# EAGLE design OpenMyxa (EAGLE 9.6.1)
Assembly variants: BASIC

## Sheet 1 of 2
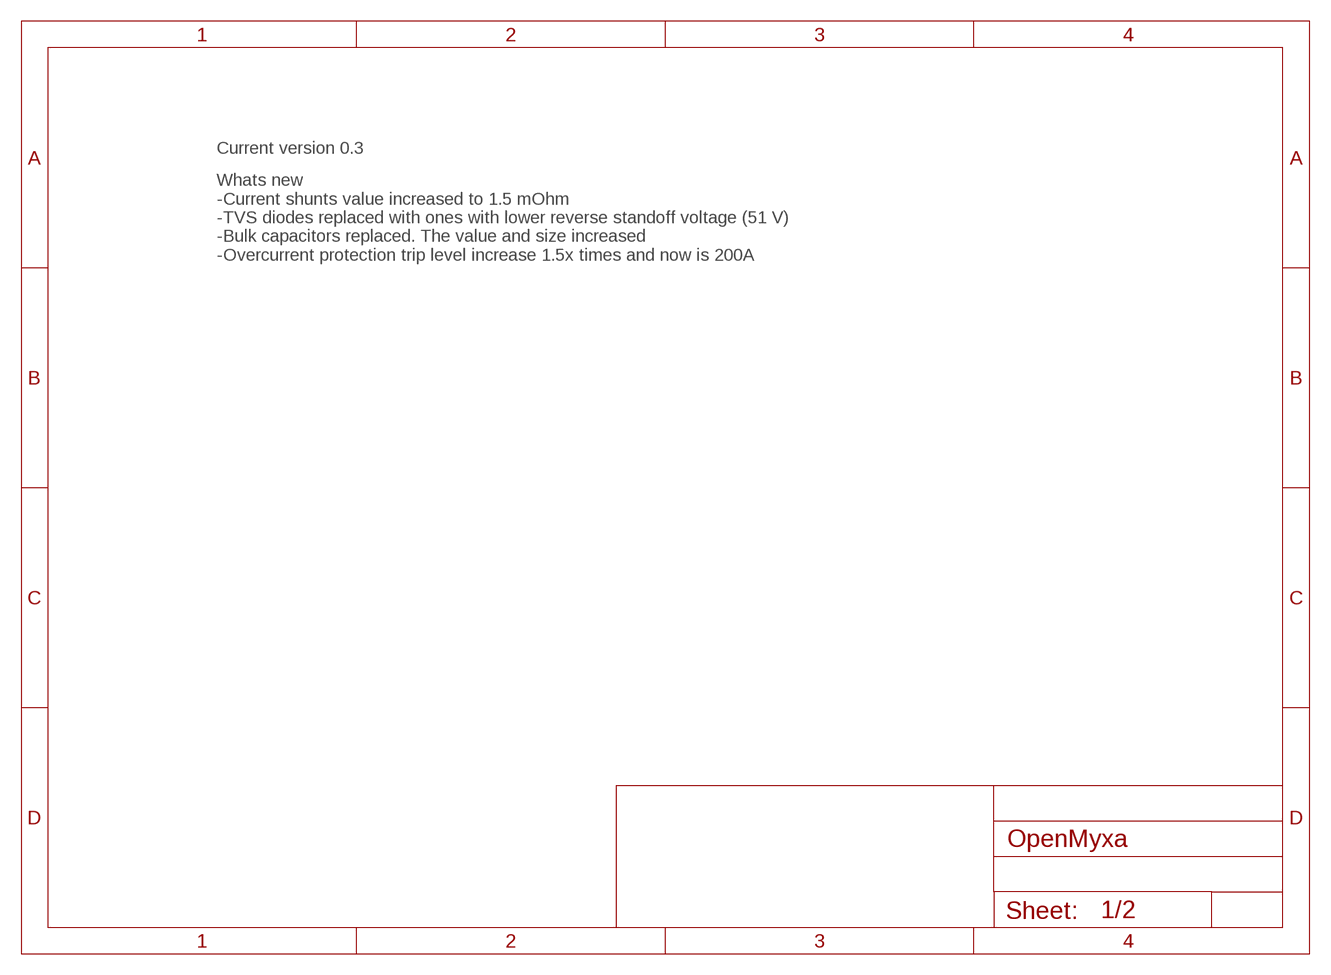
[diagram p0: schematic, sheet 1]

### Notes on the sheet
- Current version 0.3
- Whats new
  -Current shunts value increased to 1.5 mOhm
  -TVS diodes replaced with ones with lower reverse standoff voltage (51 V) 
  -Bulk capacitors replaced. The value and size increased
  -Overcurrent protection trip level increase 1.5x times and now is 200A

## Sheet 2 of 2
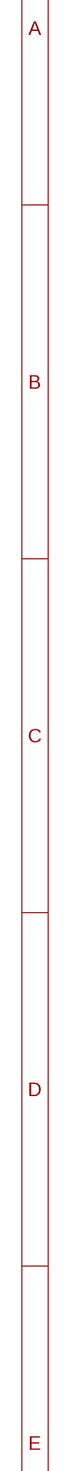
[diagram p1: schematic, sheet 2, part 1 of 2]
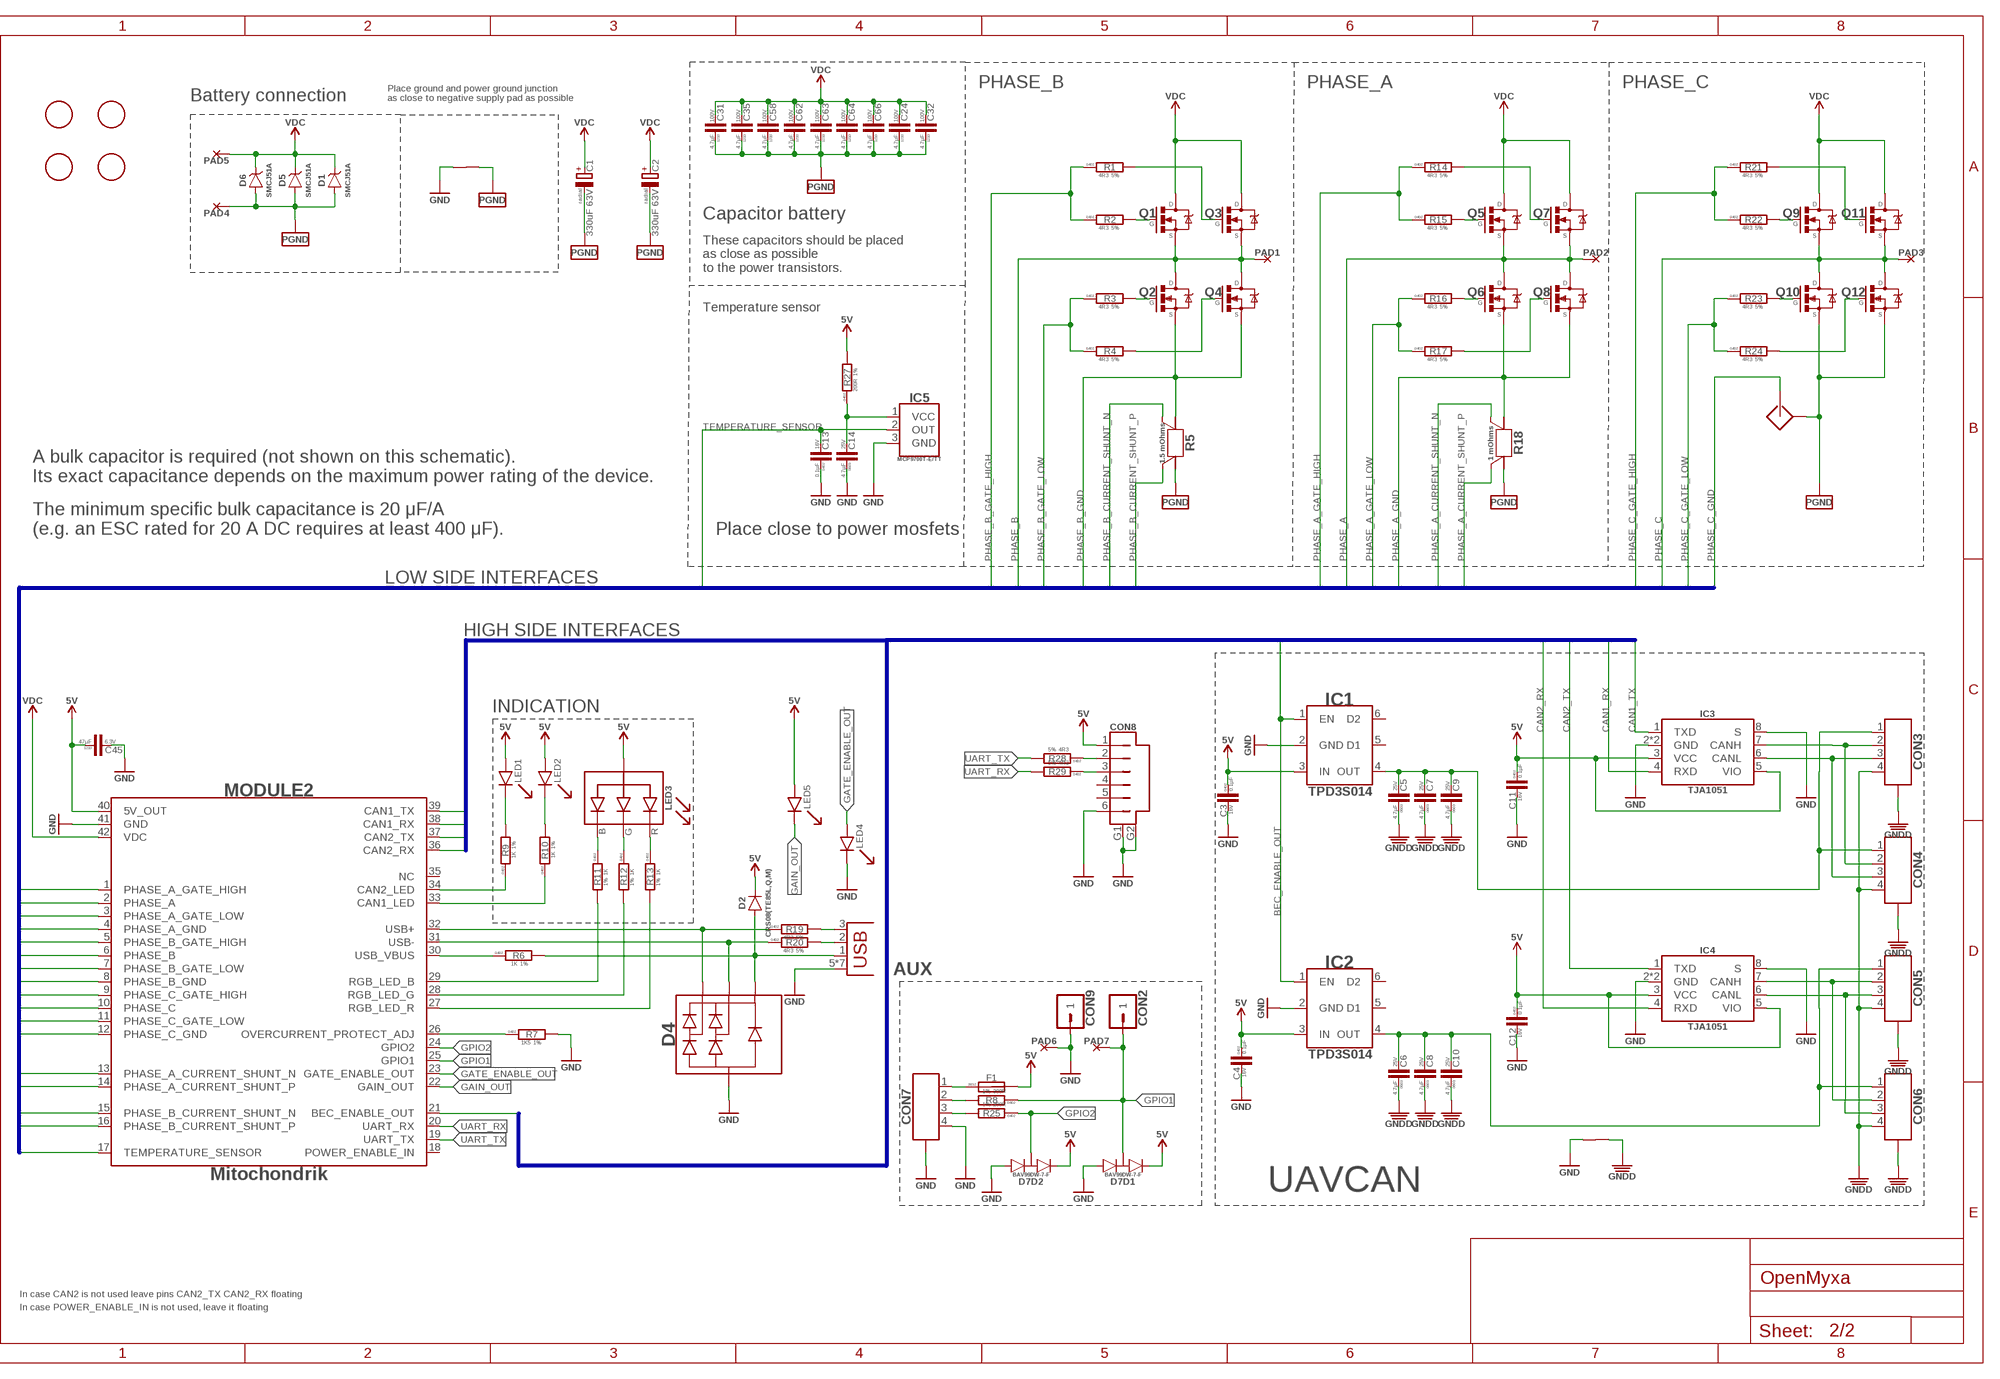
[diagram p2: schematic, sheet 2, part 2 of 2]

### Parts
C1  330uF 63V  CPOL-SIDE  [SIDE_10X22]
C2  330uF 63V  CPOL-SIDE  [SIDE_10X22]
C3  0.1µF  0.1µF-16V_10%_X7R-0402  [C0402]
C4  0.1µF  0.1µF-16V_10%_X7R-0402  [C0402]
C5  4.7µF  4.7µF-25V_10%_X6S-0603  [C0603]
C6  4.7µF  4.7µF-25V_10%_X6S-0603  [C0603]
C7  4.7µF  4.7µF-25V_10%_X6S-0603  [C0603]
C8  4.7µF  4.7µF-25V_10%_X6S-0603  [C0603]
C9  4.7µF  4.7µF-25V_10%_X6S-0603  [C0603]
C10  4.7µF  4.7µF-25V_10%_X6S-0603  [C0603]
C11  0.1µF  0.1µF-16V_10%_X7R-0402  [C0402]
C12  0.1µF  0.1µF-16V_10%_X7R-0402  [C0402]
C13  0.1µF  0.1µF-16V_10%_X7R-0402  [C0402]
C14  4.7µF  4.7µF-25V_10%_X6S-0603  [C0603]
C24  4.7µF  4.7µF-100V_20%_X7S-1210  [C1210]
C31  4.7µF  4.7µF-100V_20%_X7S-1210  [C1210]
C32  4.7µF  4.7µF-100V_20%_X7S-1210  [C1210]
C35  4.7µF  4.7µF-100V_20%_X7S-1210  [C1210]
C45  47µF  47µF-6.3V-20%-X7S-1210  [C1210]  (not fitted in variant BASIC)
C58  4.7µF  4.7µF-100V_20%_X7S-1210  [C1210]
C62  4.7µF  4.7µF-100V_20%_X7S-1210  [C1210]
C63  4.7µF  4.7µF-100V_20%_X7S-1210  [C1210]
C64  4.7µF  4.7µF-100V_20%_X7S-1210  [C1210]
C66  4.7µF  4.7µF-100V_20%_X7S-1210  [C1210]
CON1  USB  [1051330011]
CON2  PINHEAD_1X01-2  [1X01-PTH-2]  (not fitted in variant BASIC)
CON3  CON-4P-TABS-STRAIGHT  [JST_GH-4P-STRAIGHT]
CON4  CON-4P-TABS-STRAIGHT  [JST_GH-4P-STRAIGHT]
CON5  CON-4P-TABS-STRAIGHT  [JST_GH-4P-STRAIGHT]
CON6  CON-4P-TABS-STRAIGHT  [JST_GH-4P-STRAIGHT]
CON7  CON-4P-TABS-STRAIGHT  [JST_GH-4P-STRAIGHT]
CON8  CON-6P  [SM06B]
CON9  PINHEAD_1X01-2  [1X01-PTH-2]  (not fitted in variant BASIC)
D1  SMCJ51A  [DO-214AB(SMC)]
D2  CRS08-SOD123  [SOD123]
D4  PRTR5V0U2X  [SOT143B]
D5  SMCJ51A  [DO-214AB(SMC)]  (not fitted in variant BASIC)
D6  SMCJ51A  [DO-214AB(SMC)]  (not fitted in variant BASIC)
D7  BAV99DW  [SOT363]
F1  FUSE-1812  [F1812]
IC1  TPD3S014DBVR-SOT23-6  [SOT26]
IC2  TPD3S014DBVR-SOT23-6  [SOT26]
IC3  TJA1051  [SOT782-1]
IC4  TJA1051  [SOT782-1]
IC5  MCP9700  [SOT23B-3]
LED1  GREEN  LED-GREEN-0402  [0402_LED]
LED2  GREEN  LED-GREEN-0402  [0402_LED]
LED3  LTST-C19HE1WT  [LITE_ON_RGB_LED]
LED4  ORANGE  LED-ORANGE-0402  [0402_LED]
LED5  ORANGE  LED-ORANGE-0402  [0402_LED]
MODULE2  MITOHONDRIQUE_V0.2-TH  [MITOHONDRIQUE-TH]
PAD1  PAD-HOLE_2  [HOLE_2]  (not fitted in variant BASIC)
PAD2  PAD-HOLE_2  [HOLE_2]  (not fitted in variant BASIC)
PAD3  PAD-HOLE_2  [HOLE_2]  (not fitted in variant BASIC)
PAD4  PAD-HOLE_2.5  [HOLE_2.5]  (not fitted in variant BASIC)
PAD5  PAD-HOLE_2.5  [HOLE_2.5]  (not fitted in variant BASIC)
PAD6  PAD-3X1.5  [3X1.5]  (not fitted in variant BASIC)
PAD7  PAD-3X1.5  [3X1.5]  (not fitted in variant BASIC)
Q1  BSC040N08NS5ATMA1-PG-TDSON-8-7  [PG-TDSON-8-7]
Q2  BSC040N08NS5ATMA1-PG-TDSON-8-7  [PG-TDSON-8-7]
Q3  BSC040N08NS5ATMA1-PG-TDSON-8-7  [PG-TDSON-8-7]
Q4  BSC040N08NS5ATMA1-PG-TDSON-8-7  [PG-TDSON-8-7]
Q5  BSC040N08NS5ATMA1-PG-TDSON-8-7  [PG-TDSON-8-7]
Q6  BSC040N08NS5ATMA1-PG-TDSON-8-7  [PG-TDSON-8-7]
Q7  BSC040N08NS5ATMA1-PG-TDSON-8-7  [PG-TDSON-8-7]
Q8  BSC040N08NS5ATMA1-PG-TDSON-8-7  [PG-TDSON-8-7]
Q9  BSC040N08NS5ATMA1-PG-TDSON-8-7  [PG-TDSON-8-7]
Q10  BSC040N08NS5ATMA1-PG-TDSON-8-7  [PG-TDSON-8-7]
Q11  BSC040N08NS5ATMA1-PG-TDSON-8-7  [PG-TDSON-8-7]
Q12  BSC040N08NS5ATMA1-PG-TDSON-8-7  [PG-TDSON-8-7]
R1  4R3  4R3-5%-0402  [R0402]
R2  4R3  4R3-5%-0402  [R0402]
R3  4R3  4R3-5%-0402  [R0402]
R4  4R3  4R3-5%-0402  [R0402]
R5  1.5 mOhms  CURRENT_SHUNT_KELVIN-0.001R-2512-KELVIN  [R2512-KELVIN]
R6  1K  1K-1%-0402  [R0402]
R7  1K5  R-1%-0402  [R0402]
R8  200R  200R-1%-0402  [R0402]
R9  1K  1K-1%-0402  [R0402]
R10  1K  1K-1%-0402  [R0402]
R11  1K  1K-1%-0402  [R0402]
R12  1K  1K-1%-0402  [R0402]
R13  1K  1K-1%-0402  [R0402]
R14  4R3  4R3-5%-0402  [R0402]
R15  4R3  4R3-5%-0402  [R0402]
R16  4R3  4R3-5%-0402  [R0402]
R17  4R3  4R3-5%-0402  [R0402]
R18  1 mOhms  CURRENT_SHUNT_KELVIN-0.001R-2512-KELVIN  [R2512-KELVIN]
R19  4R3  4R3-5%-0402  [R0402]
R20  4R3  4R3-5%-0402  [R0402]
R21  4R3  4R3-5%-0402  [R0402]
R22  4R3  4R3-5%-0402  [R0402]
R23  4R3  4R3-5%-0402  [R0402]
R24  4R3  4R3-5%-0402  [R0402]
R25  200R  200R-1%-0402  [R0402]
R27  200R  200R-1%-0402  [R0402]
R28  4R3  4R3-5%-0402  [R0402]
R29  4R3  4R3-5%-0402  [R0402]
S1  SENSE  [CURRENT_SHUNT_SENSE]  (not fitted in variant BASIC)
U$1  CONNECTION  [CONNECTION]  (not fitted in variant BASIC)
U$3  CONNECTION  [CONNECTION]  (not fitted in variant BASIC)
U$5  FIDUCIALMOUNT  [FIDUCIA-MOUNT]
U$6  FIDUCIALMOUNT  [FIDUCIA-MOUNT]
U$7  FIDUCIALMOUNT  [FIDUCIA-MOUNT]
U$11  FIDUCIALMOUNT  [FIDUCIA-MOUNT]

### Nets
BEC_ENABLE_OUT: IC1.1(EN) IC2.1(EN) MODULE2.21(BEC_ENABLE_OUT)
CAN1_LED: MODULE2.33(CAN1_LED) R10.1
CAN1_RX: IC3.4(RXD) MODULE2.38(CAN1_RX)
CAN1_TX: IC3.1(TXD) MODULE2.39(CAN1_TX)
CAN1_VDD: C5.P$2 C7.P$2 C9.P$2 CON3.1 CON4.1 IC1.4(OUT)
CAN2_LED: MODULE2.34(CAN2_LED) R9.1
CAN2_RX: IC4.4(RXD) MODULE2.36(CAN2_RX)
CAN2_TX: IC4.1(TXD) MODULE2.37(CAN2_TX)
CAN2_VDD: C6.P$2 C8.P$2 C10.P$2 CON5.1 CON6.1 IC2.4(OUT)
GAIN_OUT: LED5.C MODULE2.22(GAIN_OUT)
GATE_ENABLE_OUT: LED4.A MODULE2.23(GATE_ENABLE_OUT)
GND: C3.2 C4.2 C11.2 C12.2 C13.1 C14.P$1 C45.2 CON1.5(GND) CON1.P$1(GND) CON1.P$2(GND) CON1.P$3(GND) CON1.P$4(GND) CON1.P$5(GND) CON1.P$6(GND) CON7.4 CON7.M$0(GND) CON7.M$1(GND) CON8.6 CON8.G1 CON8.G2 CON9.1 D4.1(C) D7.1(D1:A) D7.4(D2:A) IC1.2(GND) IC2.2(GND) IC3.2(GND) IC3.8(S) IC3.PAD(GND) IC4.2(GND) IC4.8(S) IC4.PAD(GND) IC5.3(GND) LED4.C MODULE2.41(GND) PAD6.P$1 R7.2 U$1.P$1 U$3.P$1
GNDD: C5.P$1 C6.P$1 C7.P$1 C8.P$1 C9.P$1 C10.P$1 CON3.4 CON3.M$0(GND) CON3.M$1(GND) CON4.4 CON4.M$0(GND) CON4.M$1(GND) CON5.4 CON5.M$0(GND) CON5.M$1(GND) CON6.4 CON6.M$0(GND) CON6.M$1(GND) U$1.P$2
GPIO1: CON2.1 D7.6(D1:COMMON) MODULE2.25(GPIO1) PAD7.P$1 R8.1
GPIO2: D7.3(D2:COMMON) MODULE2.24(GPIO2) R25.1
LED_BLUE: MODULE2.29(RGB_LED_B) R11.2
LED_GREEN: MODULE2.28(RGB_LED_G) R12.2
LED_RED: MODULE2.27(RGB_LED_R) R13.2
N$1 [HV]: Q1.4G(G) R2.2
N$2: Q2.4G(G) R3.2
N$3: Q4.4G(G) R4.2
N$4 [HV]: Q3.4G(G) R1.2
N$5: MODULE2.30(USB_VBUS) R6.1
N$6: CON7.1 F1.P$1
N$7 [HV]: Q5.4G(G) R15.2
N$8: Q6.4G(G) R16.2
N$9 [HV]: Q7.4G(G) R14.2
N$10: C14.P$2 IC5.1(VCC) R27.1
N$11: Q8.4G(G) R17.2
N$12 [HV]: Q9.4G(G) R22.2
N$13: Q10.4G(G) R23.2
N$14 [HV]: Q11.4G(G) R21.2
N$15: Q12.4G(G) R24.2
N$16: LED2.C R10.2
N$17: LED1.C R9.2
N$18: MODULE2.26(OVERCURRENT_PROTECT_ADJ) R7.1
N$19: CON7.2 R8.2
N$20: CON7.3 R25.2
N$21: CON3.2 CON4.2 IC3.7(CANH)
N$22: CON3.3 CON4.3 IC3.6(CANL)
N$25: CON8.2 R28.1
N$26: CON8.3 R29.1
N$44: CON5.3 CON6.3 IC4.6(CANL)
N$46: CON5.2 CON6.2 IC4.7(CANH)
N$51: D4.3(D2) MODULE2.31(USB-) R20.1
N$52: CON1.3(D+) R19.2
N$54: CON1.2(D-) R20.2
N$55: D4.2(D1) MODULE2.32(USB+) R19.1
N$58: LED3.R R13.1
N$59: LED3.G R12.1
N$60: LED3.B R11.1
PGND: C1.- C2.- C24.1 C31.1 C32.1 C35.1 C58.1 C62.1 C63.1 C64.1 C66.1 D1.A D5.A D6.A PAD4.P$1 Q10.1S(S) Q10.2S(S) Q10.3S(S) Q12.1S(S) Q12.2S(S) Q12.3S(S) R5.2 R5.22 R18.2 R18.22 S1.SHELL(SHELLL) U$3.P$2
PHASE_A [HV]: MODULE2.2(PHASE_A) PAD2.P$1 Q5.1S(S) Q5.2S(S) Q5.3S(S) Q6.D Q7.1S(S) Q7.2S(S) Q7.3S(S) Q8.D
PHASE_A_CURRENT_SHUNT_N: MODULE2.13(PHASE_A_CURRENT_SHUNT_N) R18.S1
PHASE_A_CURRENT_SHUNT_P: MODULE2.14(PHASE_A_CURRENT_SHUNT_P) R18.S2
PHASE_A_GATE_HIGH [HV]: MODULE2.1(PHASE_A_GATE_HIGH) R14.1 R15.1
PHASE_A_GATE_LOW: MODULE2.3(PHASE_A_GATE_LOW) R16.1 R17.1
PHASE_A_GND: MODULE2.4(PHASE_A_GND) Q6.1S(S) Q6.2S(S) Q6.3S(S) Q8.1S(S) Q8.2S(S) Q8.3S(S) R18.1 R18.11
PHASE_B [HV]: MODULE2.6(PHASE_B) PAD1.P$1 Q1.1S(S) Q1.2S(S) Q1.3S(S) Q2.D Q3.1S(S) Q3.2S(S) Q3.3S(S) Q4.D
PHASE_B_CURRENT_SHUNT_N: MODULE2.15(PHASE_B_CURRENT_SHUNT_N) R5.S1
PHASE_B_CURRENT_SHUNT_P: MODULE2.16(PHASE_B_CURRENT_SHUNT_P) R5.S2
PHASE_B_GATE_HIGH [HV]: MODULE2.5(PHASE_B_GATE_HIGH) R1.1 R2.1
PHASE_B_GATE_LOW: MODULE2.7(PHASE_B_GATE_LOW) R3.1 R4.1
PHASE_B_GND: MODULE2.8(PHASE_B_GND) Q2.1S(S) Q2.2S(S) Q2.3S(S) Q4.1S(S) Q4.2S(S) Q4.3S(S) R5.1 R5.11
PHASE_C [HV]: MODULE2.10(PHASE_C) PAD3.P$1 Q9.1S(S) Q9.2S(S) Q9.3S(S) Q10.D Q11.1S(S) Q11.2S(S) Q11.3S(S) Q12.D
PHASE_C_GATE_HIGH [HV]: MODULE2.9(PHASE_C_GATE_HIGH) R21.1 R22.1
PHASE_C_GATE_LOW: MODULE2.11(PHASE_C_GATE_LOW) R23.1 R24.1
PHASE_C_GND: MODULE2.12(PHASE_C_GND) S1.IN
TEMPERATURE_SENSOR: C13.2 IC5.2(OUT) MODULE2.17(TEMPERATURE_SENSOR)
UART_RX: MODULE2.20(UART_RX) R29.2
UART_TX: MODULE2.19(UART_TX) R28.2
USB_VBUS: CON1.1(VBUS) D2.A D4.4(A) R6.2
VDC [HV]: C1.+ C2.+ C24.2 C31.2 C32.2 C35.2 C58.2 C62.2 C63.2 C64.2 C66.2 D1.C D5.C D6.C MODULE2.42(VDC) PAD5.P$1 Q1.D Q3.D Q5.D Q7.D Q9.D Q11.D
VDD_5V: C3.1 C4.1 C11.1 C12.1 C45.1 CON8.1 D2.C D7.2(D1:C) D7.5(D2:C) F1.P$2 IC1.3(IN) IC2.3(IN) IC3.3(VCC) IC3.5(VIO) IC4.3(VCC) IC4.5(VIO) LED1.A LED2.A LED3.+(A) LED5.A MODULE2.40(5V_OUT) R27.2 ; supply symbol labelled 5V
Unconnected: CON8.4 CON8.5 IC1.5(D1) IC1.6(D2) IC2.5(D1) IC2.6(D2) MODULE2.18(POWER_ENABLE_IN) MODULE2.35(NC)

### Buses
PHASE_A,PHASE_A_CURRENT_SHUNT_N,PHASE_A_CURRENT_SHUNT_P,PHASE_A_GATE_HIGH,PHASE_A_GATE_LOW,PHASE_A_GND,PHASE_B,PHASE_B_CURRENT_SHUNT_N,PHASE_B_CURRENT_SHUNT_P,PHASE_B_GATE_HIGH,PHASE_B_GATE_LOW,PHASE_B_GND,PHASE_C,PHASE_C_GATE_HIGH,PHASE_C_GATE_LOW,PHASE_C_GND,TEMPERATURE_SENSOR,TEMP_SENS
BEC_ENABLE_OUT,CAN1_RX,CAN1_TX,CAN2_RX,CAN2_TX

### Notes on the sheet
- PHASE_B | PHASE_A | PHASE_C
- Battery connection
- Place ground and power ground junction
  as close to negative supply pad as possible
- Capacitor battery
- These capacitors should be placed 
  as close as possible 
  to the power transistors.
- Temperature sensor
- A bulk capacitor is required (not shown on this schematic).
  Its exact capacitance depends on the maximum power rating of the device.
- The minimum specific bulk capacitance is 20 μF/A 
  (e.g. an ESC rated for 20 A DC requires at least 400 μF).
- Place close to power mosfets
- LOW SIDE INTERFACES
- HIGH SIDE INTERFACES
- INDICATION
- AUX
- UAVCAN
- In case CAN2 is not used leave pins CAN2_TX CAN2_RX floating
- In case POWER_ENABLE_IN is not used, leave it floating

## Library data of the parts
C1 C2 = mitohondrique:CPOL: Polar tantalum capacitor; AEC-Q: AEC-Q200; DIGIKEY#: 565-2043-ND; LIFETIME: 7000 Hrs @ 105°C; MANF: United Chemi-Con; MANF#: ELXZ630ELL331MK20S; PACKAGE: radial
C3 C4 C11-C13 = C_digikey:0.1µF; DIGIKEY#: 490-3261-1-ND; MANF: Murata Electronics North America; MANF#: GRM155R71C104KA88D; OPERATING_TEMP: -55°C ~ 125°C; PACKAGE: 0402; TC: X7R; TOLERANCE: +-10%; VOLTAGE: 16V
C5-C10 C14 = C_digikey:4.7µF; DIGIKEY#: 490-7199-1-ND; MANF: Murata Electronics North America; MANF#: GRM188C81E475KE11D; OPERATING_TEMP: -55°C ~ 105°C; PACKAGE: 0603; TC: X6S; TOLERANCE: +-10%; VOLTAGE: 25V
C24 C31 C32 C35 C58 C62-C64 C66 = myxa_masterlib:4.7µF; DIGIKEY#: 445-6043-1-ND; MANF: TDK Corporation; MANF#: C3225X7S2A475M200AB; OPERATING_TEMP: -55°C ~ 125°C; PACKAGE: 1210; TC: X7S; TOLERANCE: +-20%; VOLTAGE: 100V
C45 = C_digikey:47µF; ASSY: DNM; DIGIKEY#: 445-13045-2-ND; MANF: TDK Corporation; MANF#: CGA6P1X7S0J476M250AC; OPERATING_TEMP: -55°C ~ 125°C; PACKAGE: 1210; TC: X7S; TOLERANCE: +-20%; VOLTAGE: 6.3V
CON1 = Connectors:USB: Connector Receptacle USB - micro B 2.0 5 Position; DIGIKEY#: WM10134TR-ND; MANF: Molex LLC; MANF#: 1051330011
CON2 CON9 = pinhead:PINHEAD_1X01: pinheader 1P
CON3-CON7 = Connectors:CON-4P-TABS: Connector Receptacle 4 Position 0.049" (1.25mm) Tin Surface Mount; DIGIKEY#: 455-1580-2-ND; MANF: JST Sales America Inc; MANF#: BM04B-GHS-TBT(LF)(SN)(N)
CON8 = Connectors:CON-6P: CONN HEADER SH 6POS SIDE 1MM TIN; DIGIKEY#: 455-1806-1-ND; MANF: JST Sales America Inc; MANF#: SM06B-SRSS-TB(LF)(SN)
D1 = TVS_diodes:SMCJ51A: TVS DIODE 51V 82.4V DO214AB; DIGIKEY#: SMCJ51ALFTR-ND; MANF: Littelfuse Inc.; MANF#: SMCJ51A; REVERS_STANDOFF_V: 51V
D2 = Diodes:CRS08; DIGIKEY#: CRS08QMCT-ND; MANF: Toshiba Semiconductor and Storage; MANF#: CRS08(TE85L,Q,M)
D4 = TVS_diodes:PRTR5V0U2X; DIGIKEY#: 568-4140-2-ND; MANF: NXP USA Inc; MANF#: PRTR5V0U2X,215
D5 D6 = TVS_diodes:SMCJ51A: TVS DIODE 51V 82.4V DO214AB; ASSY: DNM; DIGIKEY#: SMCJ51ALFTR-ND; MANF: Littelfuse Inc.; MANF#: SMCJ51A; REVERS_STANDOFF_V: 51V
D7 = Diodes:BAV99DW: DIODE ARRAY GP 75V 215MA SOT363; DIGIKEY#: BAV99DW-FDICT-ND; MANF: Diodes Incorporated; MANF#: BAV99DW-7-F
F1 = rc:FUSE; DIGIKEY#: 507-1754-2-ND; MANF: Bel Fuse Inc; MANF#: 0ZCG0010FF2C; PACKAGE: 1812
IC1 IC2 = myxa_masterlib:TPD3S014DBVR; DIGIKEY#: 296-38835-1-ND; MANF: Texas Instruments; MANF#: TPD3S014DBVR
IC3 IC4 = myxa_masterlib:TJA1051: 1/1 Transceiver Half CAN 8-HVSON (3x3); DIGIKEY#: 568-8686-2-ND; MANF: NXP Semiconductors; MANF#: TJA1051TK/3,118
IC5 = myxa_masterlib:MCP9700: SENSOR TEMP ANLG VOLT SOT-23-3; DIGIKEY#: MCP9700T-E/TTTR-ND; MANF: Microchip Technology; MANF#: MCP9700T-E/TT
LED1 LED2 = myxa_masterlib:LED; COLOR: GREEN; DIGIKEY#: 511-1652-1-ND; MANF: Rohm Semiconductor; MANF#: SML-P11MTT86
LED3 = myxa_masterlib:LTST-C19HE1WT; DIGIKEY#: 160-2162-1-ND; MANF: Lite-On Inc; MANF#: LTST-C19HE1WT
LED4 LED5 = myxa_masterlib:LED; COLOR: ORANGE; DIGIKEY#: 511-1651-1-ND; MANF: Rohm Semiconductor; MANF#: SML-P11DTT86
MODULE2 = zubax_modules:MITOHONDRIQUE_V0.2; MANF: Zubax Robotics; MANF#: Mitochondrik
PAD1-PAD7 = PADS:PAD; BOM: EXCLUDE
Q1-Q12 = mosfet:BSC040N08NS5ATMA1: MOSFET N-CH 80V 100A 8TDSON; DIGIKEY#: BSC040N08NS5ATMA1CT-ND; MANF: Infineon Technologies; MANF#: BSC040N08NS5ATMA1
R1-R4 R14-R17 R19-R24 R28 R29 = R_digikey:4R3; DIGIKEY#: 311-4.3JRCT-ND; MANF: Yageo; MANF#: RC0402JR-074R3L; PACKAGE: 0402; TOLERANCE: 5%
R5 = SHUNT_RESISTORS:CURRENT_SHUNT_KELVIN; DIGIKEY#: 696-1184-1-ND; MANF: Riedon; MANF#: CSR2512C0R0015F; POWER: 3W; TC: ±50ppm/°C; TOLERANCE: ±1%; VALUE: 1 mOhms
R6 R9-R13 = R_digikey:1K; DIGIKEY#: 311-1.00KLRCT-ND; MANF: Yageo; MANF#: RC0402FR-071KL; PACKAGE: 0402; TOLERANCE: 1%
R7 = rc:R; AEC-Q: AEC-Q200; DIGIKEY#: P1.50KLCT-ND; MANF: Panasonic Electronic Components; MANF#: ERJ-2RKF1501X; PACKAGE: 0402; TOLERANCE: 1%
R8 R25 R27 = R_digikey:200R; DIGIKEY#: 311-200LRCT-ND; MANF: Yageo; MANF#: RC0402FR-07200RL; PACKAGE: 0402; TOLERANCE: 1%
R18 = SHUNT_RESISTORS:CURRENT_SHUNT_KELVIN; DIGIKEY#: 696-1184-1-ND; MANF: Riedon; MANF#: CSR2512C0R0015F; POWER: 3W; TC: ±50ppm/°C; TOLERANCE: ±1%
S1 = macaroni_masterlib:SENSE; BOM: EXCLUDE
U$1 U$3 = usb2can_master_lib:CONNECTION; BOM: EXCLUDE
U$5-U$7 U$11 = usb2can_master_lib:FIDUCIALMOUNT

## Net classes
1 HV: clearance 0.25 mm to class 0, clearance 0.25 mm

## Board
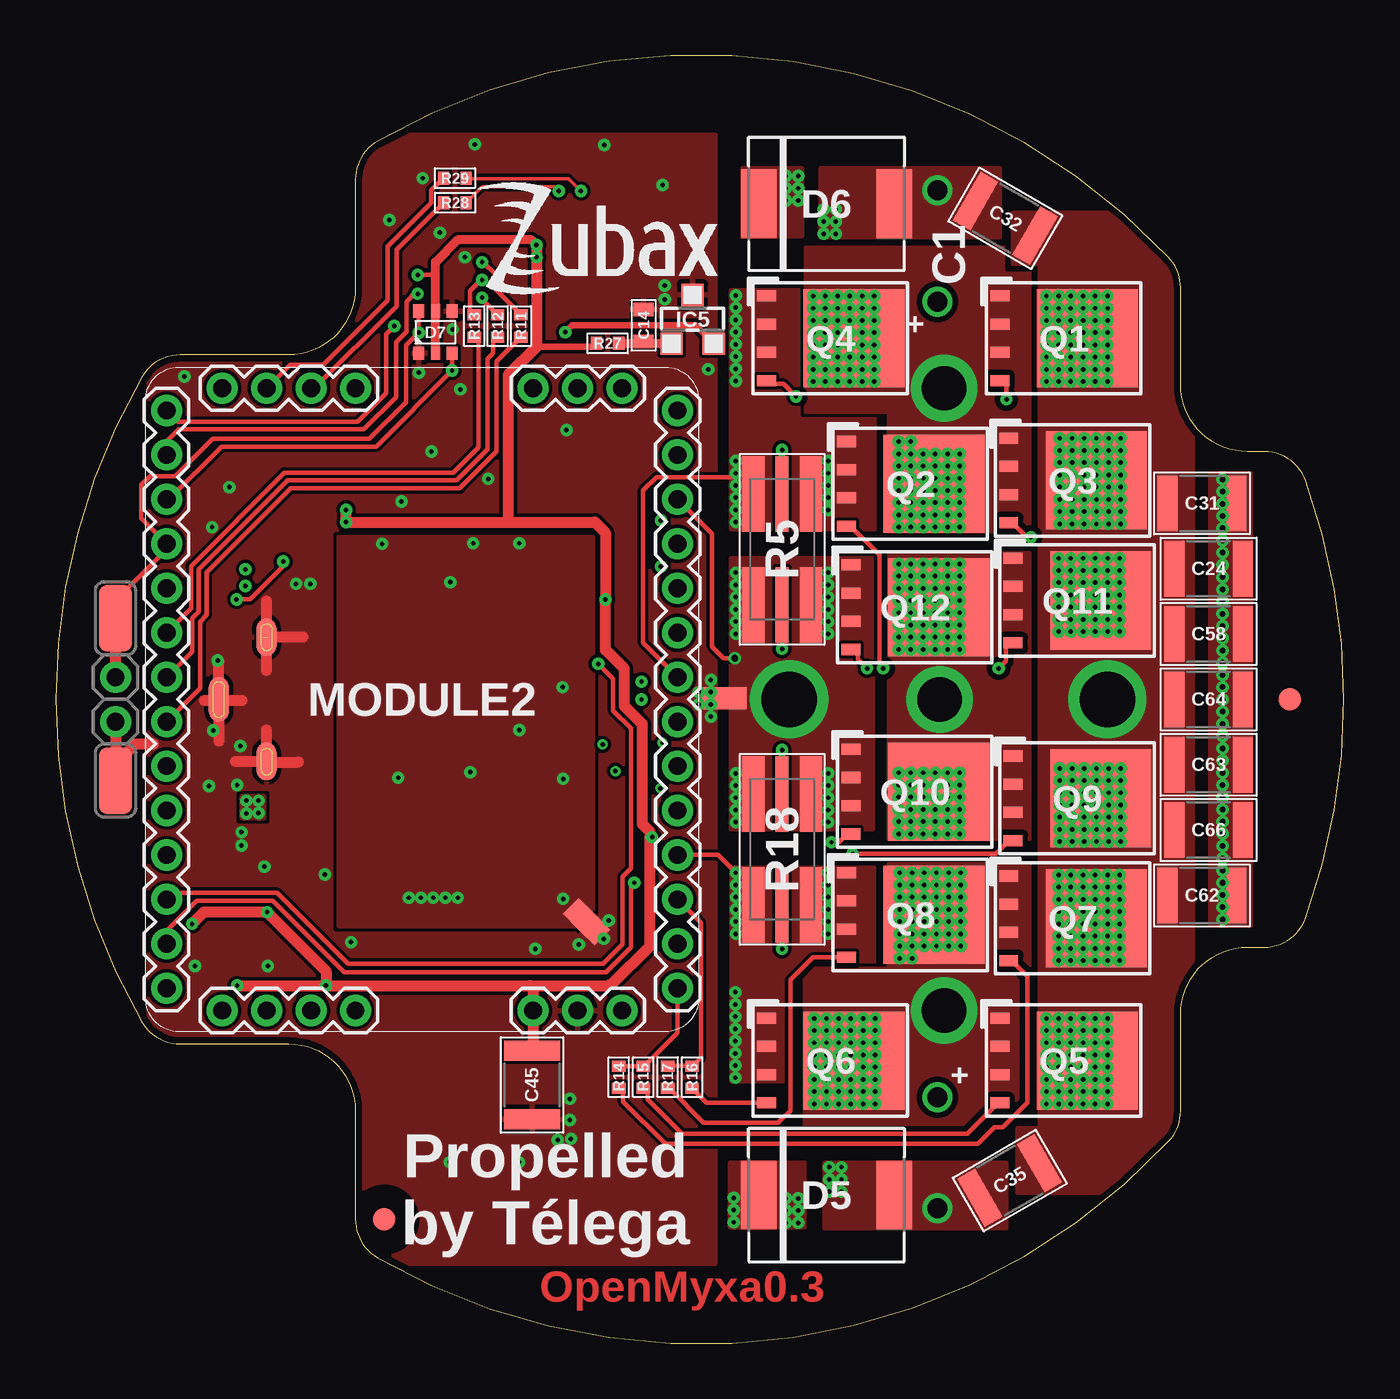
[diagram p3: board, top side]
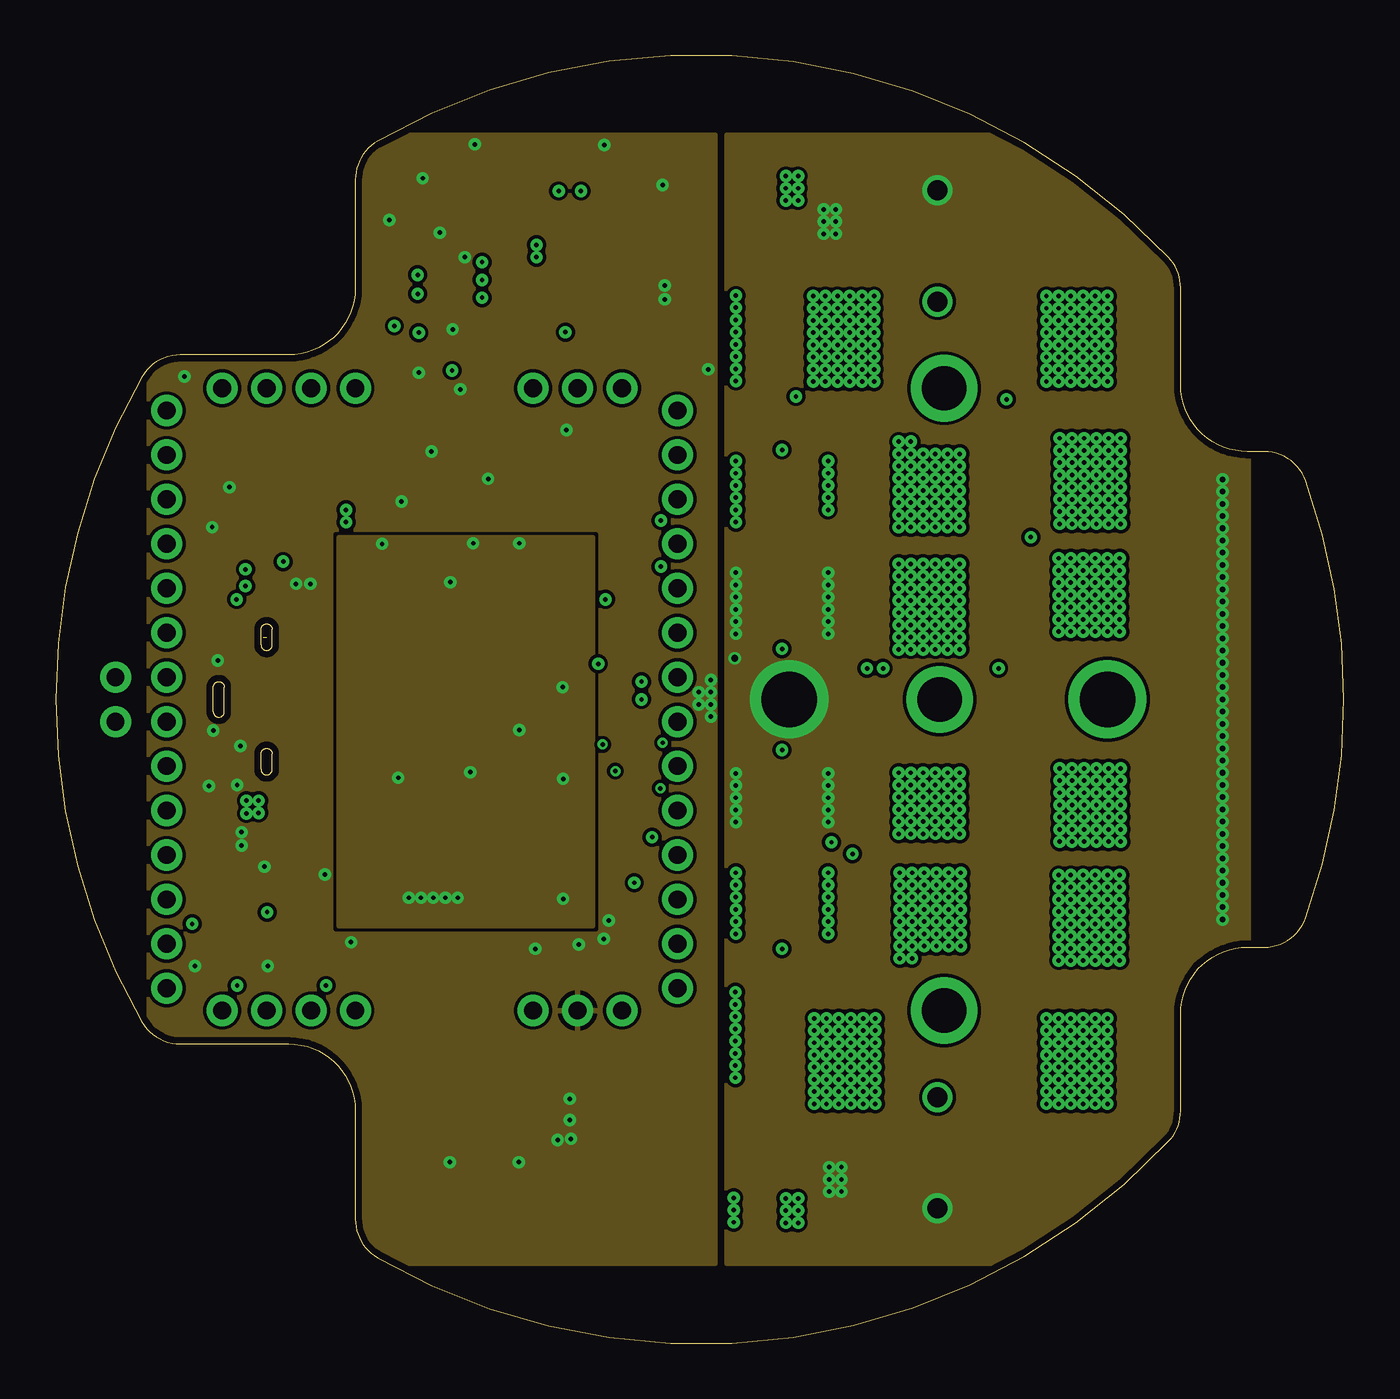
[diagram p4: board, inner layer Route2]
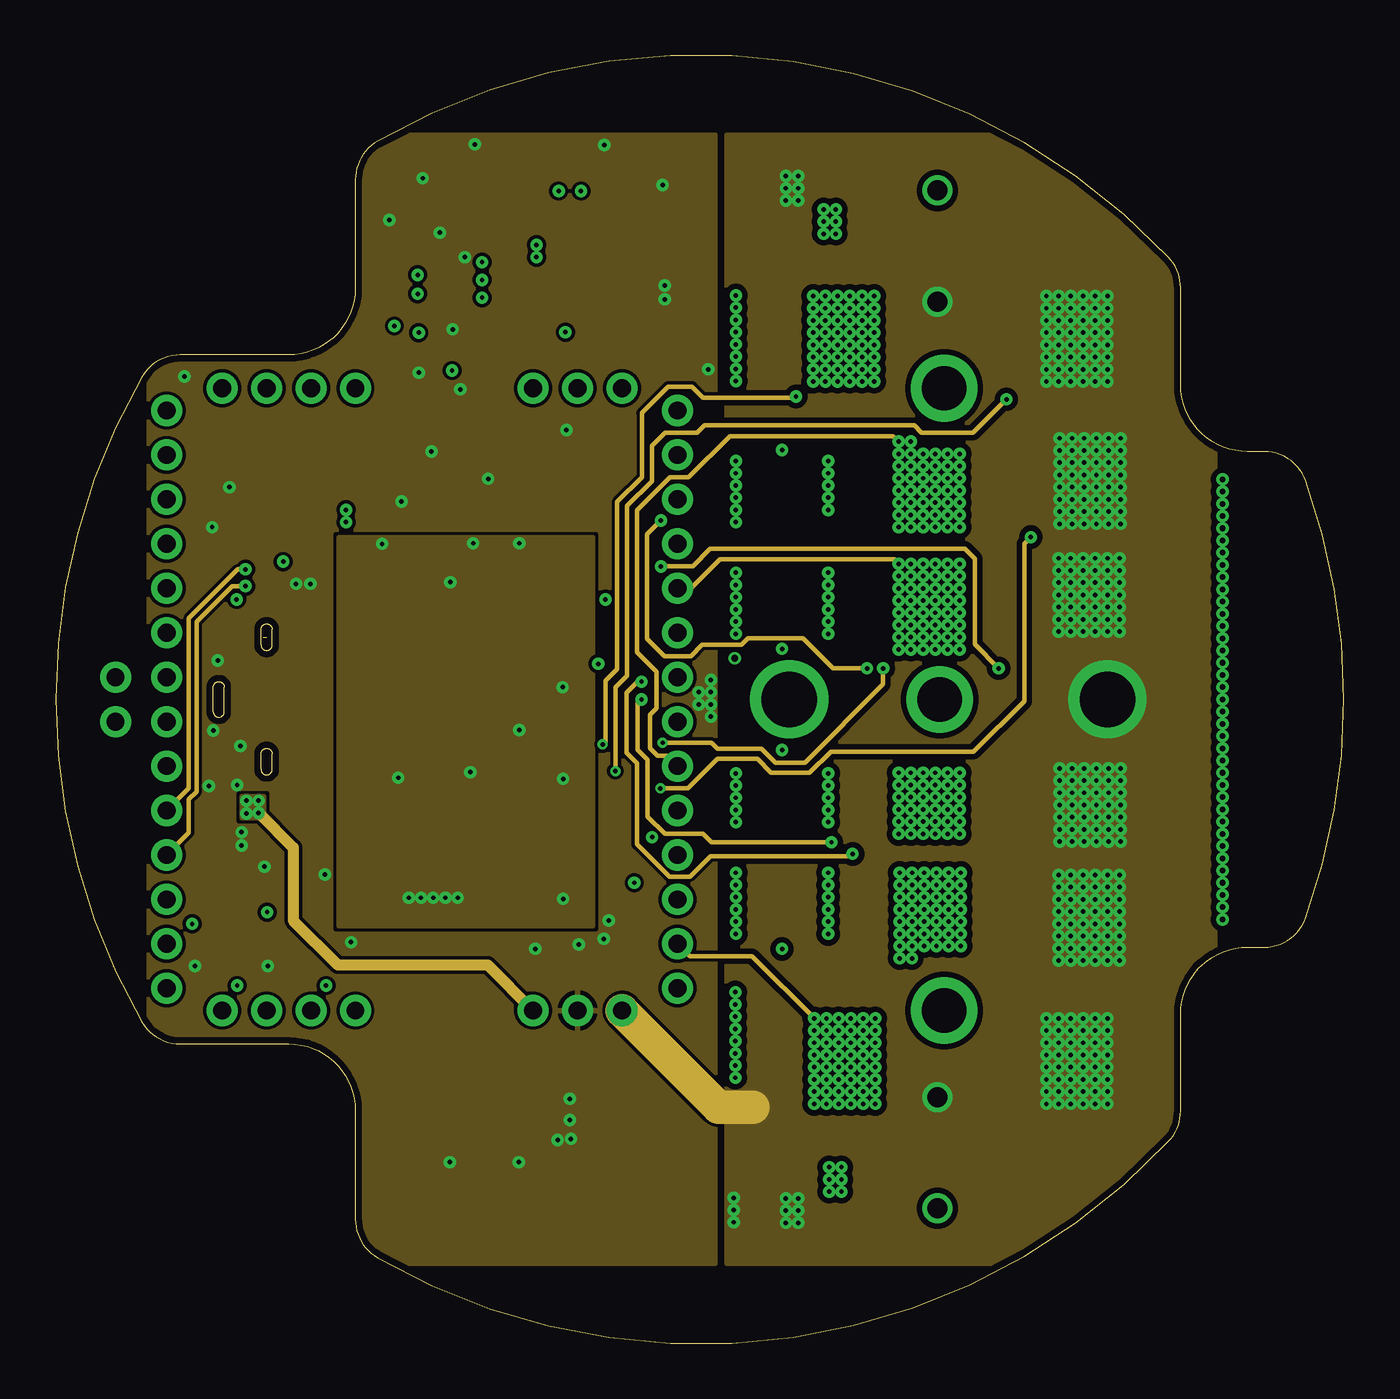
[diagram p5: board, inner layer Route15]
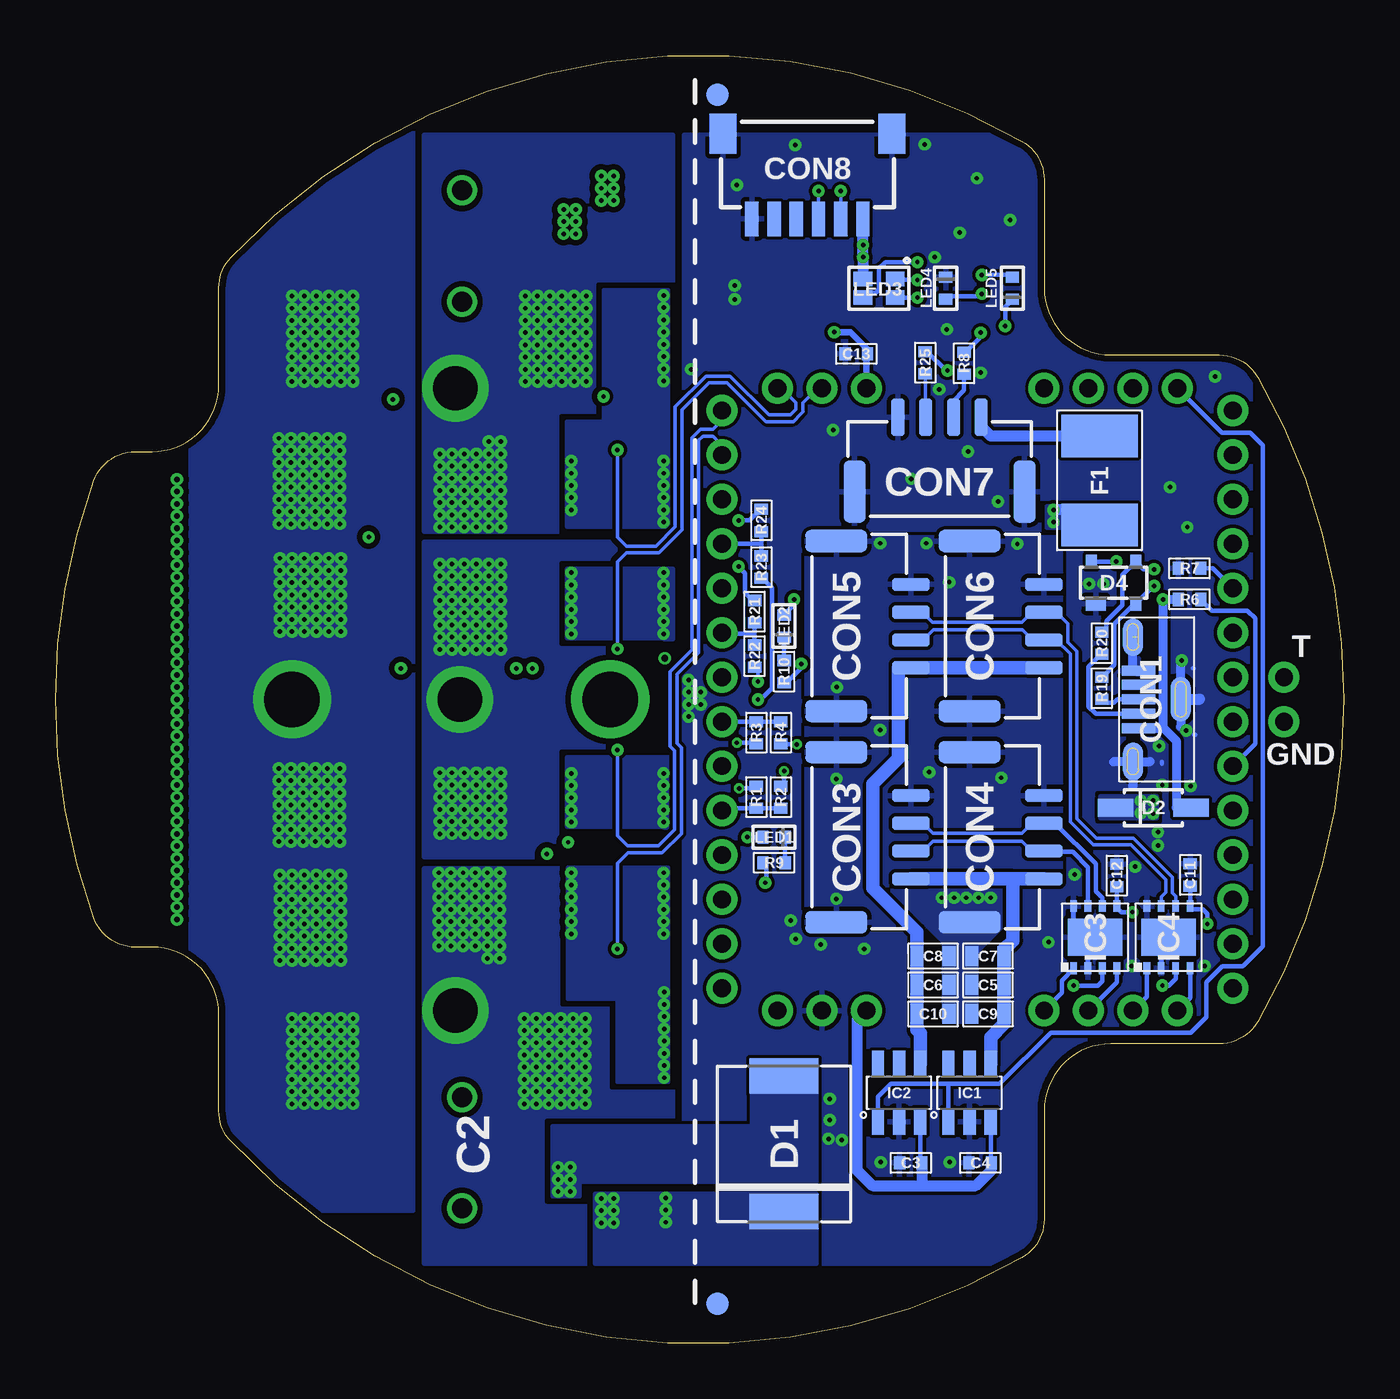
[diagram p6: board, bottom side, seen from below]

Size 57.99 x 57.94 mm. Coordinates in mm from the lower left corner, seen from the top.
Outline: 50.64,14.82 arc-90 53.64,17.82 54.4,17.82 arc70 56.28,19.14 arc40 56.28,38.8 arc70 54.4,40.12 53.64,40.12 arc-90 50.64,43.12 50.64,47.49 arc43 50.1,48.86 arc77 14.49,54.08 arc60 13.49,52.35 13.49,47.47 arc-90 10.49,44.47 5.62,44.47 arc60 3.89,43.47 arc60 3.89,14.47 arc60 5.62,13.47 10.49,13.47 arc-90 13.49,10.47 13.49,5.59 arc60 14.49,3.85 arc77 50.1,9.08 arc43 50.64,10.45 50.64,14.82
Copper layers (1+2*15+16): Top 0.035mm / dielectric 0.12mm / Route2 0.035mm / dielectric 1.2mm / Route15 0.035mm / dielectric 0.12mm / Bottom 0.035mm
Design rules "design rules": minimum track width 0.15mm, minimum drill 0.2mm, track to track 0.15mm, track to pad 0.15mm, pad to pad 0.15mm, via to via 0.15mm, smd to smd 0.15mm, copper to edge 0.3mm, drill to drill 0.2mm, minimum pad ring 0.125mm, minimum via ring 0.125mm, stop-mask expansion 1mil, vias tented up to drill 0.31mm, thermal gap 8mil

### Footprints (pad centres in the part's own frame; a part is rotated, then mirrored left to right if it is on the bottom)
SIDE_10X22 = drill 0.9: + -2.5,-0.5; - 2.5,-0.5
C0402 = smd 0.5 x 0.6: 1 -0.5,0; 2 0.5,0
C0603 = smd 0.6 x 0.9: P$1 -0.725,0; P$2 0.725,0
C1210 = smd 0.9 x 2.5: 1 -1.55,0; 2 1.55,0
1051330011 = smd 0.45 x 1.5: 1 -1.3,-0.25; 2 -0.65,-0.25; 3 0,-0.25; 4 0.65,-0.25; 5 1.3,-0.25 | smd 2 x 0.9: P$1 0,-2.15 | smd 1.7 x 0.9 bottom: P$2 -2.8,0; P$5 2.8,0 | smd 1.7 x 0.9: P$3 2.8,0; P$4 -2.8,0 | smd 2 x 0.9 bottom: P$6 0,-2.15
1X01-PTH-2 = drill 0.8 pad 1.4: 1 0,0
JST_GH-4P-STRAIGHT = smd 0.6 x 1.7: 1 -1.875,-2.9; 2 -0.625,-2.9; 3 0.625,-2.9; 4 1.875,-2.9 | smd 1 x 2.8: M$0 -3.825,0.45; M$1 3.825,0.45
SM06B = smd 0.6 x 1.55: 1 -2.5,2.275; 2 -1.5,2.275; 3 -0.5,2.275; 4 0.5,2.275; 5 1.5,2.275; 6 2.5,2.275 | smd 1.2 x 1.8: G1 -3.8,-1.55; G2 3.8,-1.55
DO-214AB(SMC) = smd 1.6 x 3.1: A 3.05,0; C -3.05,0
SOD123 = smd 1.6 x 0.8: A -1.7,0; C 1.7,0
SOT143B = smd 0.9 x 0.6: 1 -0.8,-0.95 | smd 0.5 x 0.6: 2 1,-0.95; 3 1,0.95; 4 -1,0.95
SOT363 = smd 0.6 x 0.5: 1 -0.95,0.75; 3 -0.95,-0.75; 4 0.95,-0.75; 6 0.95,0.75 | smd 0.6 x 0.4: 2 -0.95,0; 5 0.95,0
F1812 = smd 1.9 x 3.45: P$1 -2,0; P$2 2,0
SOT26 = smd 1.2 x 0.55: 1 -1.3,0.95; 2 -1.3,0; 3 -1.3,-0.95; 4 1.3,-0.95; 5 1.3,0; 6 1.3,0.95
SOT782-1 = smd 0.525 x 0.3: 1 -1.4,0.975; 2 -1.4,0.325; 3 -1.4,-0.325; 4 -1.4,-0.975; 5 1.4,-0.975; 6 1.4,-0.325; 7 1.4,0.325; 8 1.4,0.975 | smd 1.65 x 2.45: PAD 0,0
SOT23B-3 = smd 1 x 1: 1 -0.95,-1.1; 2 0.95,-1.1; 3 0,1.1
0402_LED = smd 0.5 x 0.6: A 0.5,0; C -0.5,0
LITE_ON_RGB_LED = smd 0.65 x 0.85: + -0.425,-0.725; B 0.425,-0.725; G 0.425,0.725; R -0.425,0.725
MITOHONDRIQUE-TH = drill 0.8 pad 1.4: 1 -11.5,13; 2 -11.5,11; 3 -11.5,9; 4 -11.5,7; 5 -11.5,5; 6 -11.5,3; 7 -11.5,1; 8 -11.5,-1; 9 -11.5,-3; 10 -11.5,-5; 11 -11.5,-7; 12 -11.5,-9; 13 -11.5,-11; 14 -11.5,-13; 15 -9,-14; 16 -7,-14; 17 -5,-14; 18 3,-14; 19 5,-14; 20 7,-14; 21 9,-14; 22 11.5,-13; 23 11.5,-11; 24 11.5,-9; 25 11.5,-7; 26 11.5,-5; 27 11.5,-3; 28 11.5,-1; 29 11.5,1; 30 11.5,3; 31 11.5,5; 32 11.5,7; 33 11.5,9; 34 11.5,11; 35 11.5,13; 36 9,14; 37 7,14; 38 5,14; 39 3,14; 40 -5,14; 41 -7,14; 42 -9,14
HOLE_2 = drill 2 pad 2.7: P$1 0,0
HOLE_2.5 = drill 2.5 pad 3.3: P$1 0,0
3X1.5 = smd 3 x 1.5: P$1 0,0
PG-TDSON-8-7 = smd 0.85 x 0.5: 1S -2.9,1.905; 2S -2.9,0.635; 3S -2.9,-0.635; 4G -2.9,-1.905 | smd 4.55 x 4.41: D 1.05,0
R0402 = smd 0.5 x 0.6: 1 -0.5,0; 2 0.5,0
R2512-KELVIN = smd 3.4 x 1: 1 -2.5,1.3; 2 2.5,1.3; 11 -2.5,-1.3; 22 2.5,-1.3 | smd 3.4 x 0.6: S1 -2.5,0; S2 2.5,0
CURRENT_SHUNT_SENSE = smd 0.1 x 0.1: IN 0,0 | drill 0.3 pad 0.55: SHELL 0,0
CONNECTION = smd 1 x 1: P$1 -0.5,0; P$2 0.5,0
FIDUCIA-MOUNT = smd 1.016 x 1.016: P$1 0,0

### Placement (x,y rotation side)
C1  39.2,49.37 90 top
C2  40.2,8.57 270 top
C3  19.5,8.12 180 bottom
C4  16.38,8.12 180 bottom
C5  16.03,16.12 0 bottom
C6  18.5,16.12 180 bottom
C7  16.03,17.42 0 bottom
C8  18.5,17.42 180 bottom
C9  16.03,14.82 0 bottom
C10  18.5,14.82 180 bottom
C11  6.93,21.07 90 bottom
C12  10.23,21.04 90 bottom
C13  21.95,44.52 0 bottom
C14  26.48,45.79 270 top
C24  51.9,34.85 180 top
C31  51.6,37.79 180 top
C32  42.75,50.62 330 top
C35  42.95,7.32 30 top
C45  21.45,11.62 270 top
C58  51.9,31.91 180 top
C62  51.6,20.15 180 top
C63  51.9,26.03 180 top
C64  51.9,28.97 180 top
C66  51.9,23.09 180 top
CON1  9.5,28.97 90 bottom
CON2  2.7,29.97 270 top
CON3  22.4,22.77 90 bottom
CON4  16.4,22.77 90 bottom
CON5  22.4,32.27 90 bottom
CON6  16.4,32.27 90 bottom
CON7  18.2,38.77 180 bottom
CON8  24.15,52.87 180 bottom
CON9  2.7,27.97 270 top
D1  25.2,8.97 90 bottom
D2  8.58,24.09 180 bottom
D4  10.38,34.22 0 bottom
D5  34.7,6.67 0 top
D6  34.7,51.27 0 top
D7  17.1,45.49 90 top
F1  11,38.82 270 bottom
IC1  16.85,11.27 90 bottom
IC2  20.03,11.27 90 bottom
IC3  11.2,18.27 90 bottom
IC4  7.9,18.27 90 bottom
IC5  28.68,46.07 0 top
LED1  25.65,22.77 180 bottom
LED2  25.2,32.27 90 bottom
LED3  20.93,47.47 270 bottom
LED4  17.93,47.47 270 bottom
LED5  14.93,47.47 90 bottom
MODULE2  16.5,28.97 180 top
PAD1  40,42.97 0 top
PAD2  40,14.97 180 top
PAD3  39.8,28.97 0 top
PAD4  33.03,28.97 180 top
PAD5  47.35,28.97 180 top
PAD6  2.7,25.32 270 top
PAD7  2.7,32.62 270 top
Q1  45.4,45.22 0 top
Q2  38.5,38.67 0 top
Q3  45.8,38.82 0 top
Q4  34.9,45.22 0 top
Q5  45.4,12.72 0 top
Q6  34.9,12.72 0 top
Q7  45.8,19.12 0 top
Q8  38.5,19.27 0 top
Q9  46,24.52 0 top
Q10  38.7,24.82 0 top
Q11  46,33.42 0 top
Q12  38.7,33.12 0 top
R1  26.45,24.57 90 bottom
R2  25.35,24.57 90 bottom
R3  26.45,27.47 270 bottom
R4  25.35,27.47 270 bottom
R5  32.7,35.72 270 top
R6  6.95,33.47 180 bottom
R7  6.95,34.87 180 bottom
R8  17.1,44.09 270 bottom
R9  25.65,21.62 0 bottom
R10  25.2,30.22 90 bottom
R11  20.95,45.77 270 top
R12  19.9,45.77 270 top
R13  18.85,45.77 270 top
R14  25.35,11.97 270 top
R15  26.45,11.97 270 top
R16  28.65,11.97 270 top
R17  27.55,11.97 270 top
R18  32.7,22.22 90 top
R19  10.9,29.47 270 bottom
R20  10.9,31.49 270 bottom
R21  26.53,32.92 90 bottom
R22  26.53,30.92 270 bottom
R23  26.23,34.92 270 bottom
R24  26.23,37.02 90 bottom
R25  18.85,44.12 270 bottom
R27  24.85,44.99 180 top
R28  17.98,51.32 180 top
R29  17.98,52.42 180 top
S1  30.58,30.82 0 top
U$1  23.9,18.97 135 top
U$3  30.1,29.02 0 top
U$5  55.55,28.97 0 top
U$6  14.8,5.57 0 top
U$7  28.2,56.17 0 bottom
U$11  28.2,1.77 0 bottom
U$13  [ZUBAX_LOGO_5X10]  18.93,47.02 0 top

### Tracks (layer width: path | path; a pad name or v marks a point on that pad's centre or on a via)
BEC_ENABLE_OUT
  Bottom 0.2: 17.8,11.67 15.5,11.67 13.2,13.97 6.9,13.97 6.2,14.67 6.2,16.24 5.48,16.97 4.55,16.97 3.65,17.87 3.65,40.39 4.23,40.97 5.5,40.97 MODULE2.21 | 17.8,11.67 20.4,11.67 20.98,11.09 IC2.1 | IC1.1 17.8,11.67
CAN1_LED  (via drill 0.2 pad 0.55)
  Top 0.2: v24.43,30.57 25.1,29.89 25.1,28.46 25.9,27.66 25.9,21.37 25.53,20.99 25.53,17.95 24.65,17.07 13.17,17.07 9.97,20.27 5.3,20.27 MODULE2.33
  Bottom 0.2: R10.1 25.1,29.72 24.43,30.39 v24.43,30.57
CAN1_RX
  Bottom 0.2: IC3.4 10.23,16.24 MODULE2.38
CAN1_TX
  Bottom 0.2: IC3.1 12.18,16.84 12.7,16.32 12.7,15.77 MODULE2.39
CAN1_VDD
  Bottom 0.6: IC1.4 15.9,13.77 15.3,14.37 C9.P$2 C5.P$2 C7.P$2 15.3,17.72 14.9,18.12 14.9,20.89 | 14.9,20.89 CON4.1 | 14.9,20.89 CON3.1
CAN2_LED  (via drill 0.2 pad 0.55)
  Top 0.2: v26.05,20.72 25.9,20.57 25.9,17.83 24.77,16.69 13,16.69 9.78,19.92 6.35,19.92 5,18.57 MODULE2.34
  Bottom 0.2: R9.1 26,21.47 26,20.77 v26.05,20.72
CAN2_RX
  Bottom 0.2: IC4.4 6.93,15.54 MODULE2.36
CAN2_TX
  Bottom 0.2: IC4.1 8.88,15.59 MODULE2.37
CAN2_VDD
  Bottom 0.6: IC2.4 19.08,13.94 19.23,14.09 C10.P$2 C6.P$2 C8.P$2 19.23,18.49 21.2,20.47 21.2,25.17 20.05,26.32 20.05,30.39 CON5.1 CON6.1
GAIN_OUT  (via drill 0.2 pad 0.55)
  Top 0.2: v15.25,45.77 14.88,45.39 14.88,42.74 13.6,41.47 6,41.47 5.5,41.47 MODULE2.22
  Bottom 0.2: LED5.C 15.25,46.64 v15.25,45.77
GATE_ENABLE_OUT  (via drill 0.2 pad 0.55)
  Top 0.2: v16.3,47.22 16.15,47.22 15.8,46.87 15.8,45.52 15.33,45.04 15.33,42.57 13.87,41.12 5.55,41.12 5,40.57 MODULE2.23
  Bottom 0.2: v16.3,47.22 16.4,47.12 17.78,47.12 LED4.A
GND  (via drill 0.2 pad 0.55)  (2 unrouted)
  Top 0.4: 7.35,30.67 v7.3,30.72 | CON1.P$6 8.4,28.97
  Top 0.5: CON1.P$4 8.1,26.17 | 10.93,26.14 9.53,26.14 CON1.P$4 | CON1.P$4 9.5,27.59 | 7.35,30.67 CON1.P$6 7.35,27.09 | 9.5,30.27 9.5,33.39 | 11.13,31.77 9.35,31.77 | CON9.1 PAD6.P$1 2.7,26.07 3.6,26.97 4.4,26.97 | 8.4,28.92 6.7,28.92
  Bottom 0.2: 6.75,27.37 6.7,27.37 | 6.75,30.37 6.8,30.37 | 8.2,26.17 8.2,26.07 | IC4.2 8.23,17.94 IC4.PAD | IC3.2 11.53,17.94 IC3.PAD 12.18,18.27 IC3.8 | CON1.5 9.5,30.27 9.5,30.37
  Bottom 0.4: 7.35,30.54 CON1.P$6 7.35,27.74 | CON1.P$4 8.73,26.17 | CON1.P$4 10.35,26.17 10.38,26.14 | CON1.P$4 9.5,25.09 9.53,25.07 | 9.5,30.37 CON1.P$5
  Bottom 0.5: CON1.P$6 6.53,28.97 6.5,28.99
  other vias: 5.8,43.49 28.95,29.29 28.95,28.74 29.5,29.29 29.5,28.74 29.5,29.84 29.5,28.19 17.75,8.14 20.85,8.14 8.38,22.99 8.18,25.12 7.83,38.52 27.43,47.59 7.1,27.57 8.33,26.87 8.38,22.39 9.4,21.44 12.13,21.09 29.38,43.82 23,41.09 19.48,38.89 23.55,17.94 24.68,18.19 24.9,19.02 23.15,10.99 23.15,10.04 23.2,9.19 22.6,9.14 7.05,36.72 13.3,18.04 27.43,46.97 15.58,37.87 11.48,34.17 10.83,34.17 17.88,45.62 16.35,43.67 18.43,48.87 17.3,49.97 15.03,50.54 16.53,52.42 18.88,53.94 24.7,53.92 27.33,52.12 21.6,17.74 6.9,25.07 18.23,42.92 16.93,40.12 9.55,16.97 6.28,16.97
  pour Top (rank 5): 29.7,3.57 29.7,54.37 4.2,54.37 4.2,3.57
  pour Bottom (rank 5): 29.7,3.57 29.7,54.37 4.2,54.37 4.2,3.57
  pour Route2 (rank 5): 4.2,54.37 4.2,3.57 29.7,3.57 29.7,54.37
  pour Route15 (rank 5): 29.7,3.57 29.7,54.37 4.2,54.37 4.2,3.57
GNDD  (via drill 0.2 pad 0.55)
  other vias: 22.85,19.99 16.45,20.04 17.78,34.24 18.8,35.99 20.88,35.99 14.7,35.97 22.85,25.39 20.88,27.59 22.83,29.52 18.68,25.69 15.43,25.44 15.9,20.04 17,20.04 17.55,20.04 18.1,20.04
  pour Top: 12.75,36.27 24.2,36.27 24.2,18.77 12.75,18.77
  pour Route2: 12.75,36.27 24.2,36.27 24.2,18.77 12.75,18.77
  pour Route15: 12.75,36.27 24.2,36.27 24.2,18.77 12.75,18.77
  pour Bottom: 24.2,36.27 12.75,36.27 12.75,18.77 24.2,18.77
  pour Bottom (no thermals): 18,14.47 16.55,14.47 16.55,17.59 15.45,18.69 15.45,20.27 18.75,20.27 18.75,18.79 18,18.04
GPIO1  (via drill 0.2 pad 0.55)
  Top 0.2: 2.7,32.67 PAD7.P$1 | D7.6 v16.35,45.47 15.78,44.89 15.78,42.34 14.13,40.69 7.07,40.69 5.39,39.02 4.25,39.02 3.85,38.62 3.85,37.12 MODULE2.25 5,35.72 3,33.72 3,32.27 2.7,31.97
  Top 0.5: CON2.1 2.7,31.97 PAD7.P$1
  Bottom 0.2: R8.1 17.05,44.59 16.35,45.29 v16.35,45.47
GPIO2  (via drill 0.2 pad 0.55)
  Top 0.2: D7.3 v17.85,43.77 14.43,40.34 7.48,40.34 5.1,37.97 MODULE2.24
  Bottom 0.2: R25.1 18.78,44.62 17.93,43.77 v17.85,43.77
LED_BLUE
  Top 0.2: R11.2 20.43,44.74 20.42,44.74 19.85,44.17 19.85,40.13 18.19,38.47 10.59,38.47 6.8,34.68 6.8,32.77 6.5,32.47 6.5,29.47 MODULE2.29
LED_GREEN
  Top 0.2: R12.2 19.7,45.07 19.7,44.54 19.45,44.29 19.45,40.22 18.05,38.82 10.45,38.82 6.45,34.82 6.45,32.92 6.15,32.62 6.15,31.12 MODULE2.28
LED_RED
  Top 0.2: R13.2 19.05,45.07 19.05,40.32 17.9,39.17 10.3,39.17 6.1,34.97 6.1,33.07 MODULE2.27
N$1  (via drill 0.2 pad 0.45, 0.2 pad 0.55)
  Top 0.2: Q1.4G 42.8,43.31 v42.8,42.47
  Route15 0.2: v42.8,42.47 41.3,40.97 38.98,40.97 38.66,41.29 29.2,41.29 28.88,40.97 27.43,40.97 26.84,40.38 26.84,38.79 25.73,37.67 25.73,30.04 25.2,29.52 v25.2,25.74
  Bottom 0.2: v25.2,25.74 25.2,25.22 R2.2
N$2  (via drill 0.2 pad 0.45, 0.2 pad 0.55)
  Top 0.2: Q2.4G 35.78,36.76 37.08,35.47 37.08,30.69 37.25,30.52 v37.25,30.37
  Route15 0.2: v37.25,30.37 37.25,29.64 33.73,26.12 32.4,26.12 31.78,26.74 29.8,26.74 29.53,27.02 v27.33,27.02
  Bottom 0.2: v27.33,27.02 26.5,27.02 R3.2
N$3  (via drill 0.2 pad 0.45, 0.2 pad 0.55)
  Top 0.2: Q4.4G 32.15,43.16 32.76,43.16 v33.33,42.6
  Route15 0.2: v33.33,42.6 33.28,42.55 29.15,42.55 28.65,43.04 27.58,43.04 26.39,41.86 26.39,38.97 25.28,37.86 25.28,30.33 24.75,29.81 24.75,27.07 v24.63,26.94
  Bottom 0.2: R4.2 25.33,26.94 v24.63,26.94
N$4  (via drill 0.2 pad 0.45, 0.2 pad 0.55)
  Top 0.2: Q3.4G 43.08,36.91 43.73,36.27 v43.9,36.27
  Route15 0.2: v43.9,36.27 43.6,35.97 43.6,28.89 41.33,26.62 34.89,26.62 33.94,25.67 32.21,25.67 31.59,26.29 29.8,26.29 28.48,24.97 v27.23,24.97
  Bottom 0.2: R1.2 26.55,24.97 v27.23,24.97
N$5
  Bottom 0.2: R6.1 6.45,33.32 6.3,33.32 5.95,32.97 4.35,32.97 4,32.62 4,26.97 MODULE2.30
N$6
  Bottom 0.15: CON7.1 16.33,41.24
  Bottom 0.5: F1.P$1 15.9,40.82 16.33,41.24
N$7
  Top 0.2: R15.2 26.65,11.47 26.65,10.97 28.2,9.42 41.05,9.42 42.45,10.81 Q5.4G
N$8
  Top 0.2: Q6.4G 29.31,10.81 R16.2
N$9
  Top 0.2: R14.2 25.4,11.47 25.45,11.42 25.45,11.39 25.48,11.39 25.55,11.32 25.55,10.87 27.45,8.97 41.51,8.97 42.26,9.71 42.64,9.71 43.75,10.82 43.75,16.52 43.1,17.17 42.95,17.17 Q7.4G
N$10
  Top 0.4: IC5.1 26.58,44.97 C14.P$2 26.4,44.99 R27.1
N$11
  Top 0.2: R17.2 27.63,11.47 29.18,9.92 32.53,9.92 33.08,10.47 33.08,16.34 34.1,17.36 Q8.4G
N$12  (via drill 0.2 pad 0.55)
  Top 0.2: Q9.4G 42.9,22.61 42.9,22.59 42.33,22.02 v35.88,22.02
  Route15 0.2: v35.88,22.02 35.78,21.92 29.48,21.92 28.55,20.99 27.63,20.99 26.17,22.45 26.17,26.09 25.7,26.56 25.7,29.27 26.2,29.77 v26.38,29.77
  Bottom 0.15: R22.2 26.38,30.42 v26.38,29.77
N$13  (via drill 0.2 pad 0.55)
  Top 0.2: Q10.4G 35.65,22.91 35.27,22.54 v34.93,22.54
  Route15 0.2: v34.93,22.54 29.53,22.54 29.15,22.92 27.43,22.92 26.65,23.69 26.65,26.24 26.2,26.69 26.2,28.79 v26.38,28.97
  Bottom 0.2: R23.2 26.18,34.42 25.75,33.99 25.75,29.47 26.25,28.97 v26.38,28.97
N$14  (via drill 0.2 pad 0.55)
  Top 0.2: Q11.4G 42.78,31.51 42.78,30.69 v42.45,30.37
  Route15 0.2: v27.25,34.94 27.25,34.97 28.69,34.97 29.46,35.74 40.94,35.74 41.38,35.31 41.38,31.44 v42.45,30.37 | v42.45,30.37
  Bottom 0.2: R21.2 26.6,33.42 26.95,33.77 26.95,34.64 v27.25,34.94
N$15  (via drill 0.2 pad 0.55)
  Top 0.2: Q12.4G 36.13,31.21 36.13,30.77 v36.53,30.37
  Route15 0.2: v36.53,30.37 35,30.37 33.65,31.72 31.18,31.72 30.88,31.42 29.1,31.42 28.6,30.92 27.4,30.92 26.63,31.69 26.63,36.39 v27.25,37.02
  Bottom 0.2: R24.2 26.25,37.52 26.75,37.02 v27.25,37.02
N$16
  Bottom 0.2: LED2.C R10.2
N$17
  Bottom 0.2: R9.2 LED1.C
N$18
  Bottom 0.2: R7.1 5.9,34.87 MODULE2.26
N$19
  Bottom 0.15: CON7.2 17.58,42.39
  Bottom 0.2: R8.2 17.1,42.87 17.58,42.39
N$20
  Bottom 0.15: R25.2 18.85,41.69 CON7.3
N$21
  Bottom 0.15: 13,22.12 13.03,22.14 CON4.2 14.05,22.14 14.5,22.59 18.5,22.59 18.95,22.14 CON3.2
  Bottom 0.2: IC3.7 11.53,21.42 12.19,22.08 12.23,22.12 13,22.12
N$22
  Bottom 0.15: 13.01,23.39 CON4.3 14.05,23.39 14.5,22.94 18.5,22.94 18.95,23.39 CON3.3
  Bottom 0.2: IC3.6 10.88,20.04 11.18,20.34 11.18,21.56 13.01,23.39
N$25  (via drill 0.2 pad 0.55)
  Top 0.15: v22.65,51.84 22.45,52.04 19.2,52.04 R28.1
  Bottom 0.15: CON8.2 v22.65,51.84
N$26  (via drill 0.2 pad 0.55)
  Top 0.15: v23.65,51.84 23.1,52.39 18.5,52.39 R29.1
  Bottom 0.15: CON8.3 v23.65,51.84
N$44
  Bottom 0.15: IC4.6 7.58,20.12 7.73,20.27 7.73,20.97 9.48,22.72 11.15,22.72 12.03,23.59 12.03,31.14 12.43,31.54 12.43,32.37 12.95,32.89 CON6.3 14.05,32.89 14.5,32.44 18.53,32.44 18.98,32.89 CON5.3
N$46
  Bottom 0.15: IC4.7 8.23,20.09 8.03,20.29 8.03,20.85 9.6,22.42 11.27,22.42 12.33,23.47 12.33,31.02 12.94,31.63 | 12.94,31.63 12.95,31.64 | 12.95,31.64 CON6.2 14.03,31.64 14.48,32.09 18.48,32.09 18.93,31.64 CON5.2 | 12.95,31.64 12.94,31.63
N$51  (via drill 0.2 pad 0.55)
  Route15 0.2: v8.55,34.82 8.2,34.82 6,32.62 6,24.97 MODULE2.31
  Bottom 0.2: R20.1 10.7,31.99 10.7,32.49 9.98,33.21 9.98,34.57 D4.3 9.03,34.82 v8.55,34.82
N$52
  Bottom 0.2: R19.2 11.08,28.97 10.93,28.82 10.35,28.82 10.2,28.97 CON1.3
N$54
  Bottom 0.2: CON1.2 11.18,28.32 11.5,28.64 11.5,30.44 10.95,30.99 R20.2
N$55  (via drill 0.2 pad 0.55)
  Route15 0.2: v8.55,34.07 7.95,34.07 6.35,32.47 6.35,24.82 6,24.47 6,22.97 MODULE2.32
  Bottom 0.2: R19.1 10.88,29.97 10.33,30.52 10.33,32.37 9.43,33.27 D4.2 8.58,34.07 v8.55,34.07
N$58  (via drill 0.2 pad 0.55)
  Top 0.2: R13.1 18.65,46.47 18.65,47.35 19.15,47.84 v19.2,47.84
  Bottom 0.2: LED3.R 20.15,47.84 v19.2,47.84
N$59  (via drill 0.2 pad 0.55)
  Top 0.2: R12.1 19.2,46.97 v19.2,47.04
  Bottom 0.2: v19.2,47.04 LED3.G
N$60  (via drill 0.2 pad 0.55)
  Top 0.2: R11.1 19.78,47.44 19.78,48.11 19.24,48.64 v19.2,48.64
  Bottom 0.2: LED3.B 21.43,47.27 21.08,47.27 20.93,47.42 20.93,48.37 20.65,48.64 v19.2,48.64
PGND  (via drill 0.2 pad 0.55, 0.25 pad 0.55)
  Top 0.2: 32.65,28.97 32.81,28.81
  other vias: 52.53,33.37 52.53,33.92 52.53,34.47 52.53,32.82 52.53,22.37 52.53,22.92 52.53,23.47 52.53,21.82 52.53,19.62 52.53,20.17 52.53,20.72 52.53,19.07 52.53,24.57 52.53,25.12 52.53,25.67 52.53,24.02 52.53,26.77 52.53,27.32 52.53,27.87 52.53,26.22 52.53,28.97 52.53,29.52 52.53,30.07 52.53,28.42 52.53,31.17 52.53,31.72 52.53,32.27 52.53,30.62 52.53,21.27 52.53,35.57 52.53,36.12 52.53,36.67 52.53,35.02 52.53,37.77 52.53,38.32 52.53,38.87 52.53,37.22 35.38,7.37 34.83,7.37 34.83,6.82 35.38,6.82 34.83,7.92 35.38,7.92 35.13,49.92 34.58,49.92 34.58,51.02 35.13,51.02 34.58,50.47 35.13,50.47 30.63,25.64 30.63,25.09 30.63,24.54 30.63,23.99 30.63,23.44 34.78,25.64 34.78,25.09 34.78,24.54 34.78,23.99 34.78,23.44 30.63,34.12 30.63,33.57 30.63,33.02 30.63,32.47 30.63,31.92 34.78,34.67 34.78,34.12 34.78,33.57 34.78,33.02 34.78,32.47 34.78,31.92 30.63,34.67
  pour Top (no thermals): 36.8,23.12 36.8,35.33 30.4,35.33 30.4,23.12
  pour Top (no thermals): 51.95,18.77 53.83,18.77 53.83,39.17 51.95,39.17
  pour Route2 (no thermals): 30.2,54.37 30.2,3.57 53.7,3.57 53.7,54.37
  pour Top (no thermals): 42.8,5.17 34.6,5.17 34.6,8.12 42.8,8.12
  pour Top (no thermals): 42.5,49.77 37,49.77 37,52.87 42.5,52.87
  pour Bottom: 30.58,23.2 30.2,23.2 30.2,26.37 34.98,26.37 34.98,23.24 30.54,23.24
  pour Bottom: 30.58,31.68 30.2,31.67 30.2,34.84 34.98,34.84 34.98,31.72 30.54,31.72
  pour Bottom (no thermals): 23.75,12.72 23.75,7.27 34.4,7.27 34.4,6.62 35.63,6.62 35.63,9.77 26.65,9.77 26.65,12.72
  pour Top (no thermals): 34.43,52.87 38.4,52.87 38.4,49.77 34.43,49.77
PHASE_A  (via drill 0.2 pad 0.55)
  Route15 0.2: v34.15,14.62 31.35,17.42 28.55,17.42 MODULE2.2
  other vias: 34.15,14.07 34.7,14.07 35.25,14.07 35.8,14.07 36.35,14.07 36.9,14.07 34.7,14.62 35.25,14.62 35.8,14.62 36.35,14.62 36.9,14.62 34.15,13.52 34.7,13.52 35.25,13.52 35.8,13.52 36.35,13.52 36.9,13.52 34.15,12.42 34.7,12.42 35.25,12.42 35.8,12.42 36.35,12.42 36.9,12.42 34.15,12.97 34.7,12.97 35.25,12.97 35.8,12.97 36.35,12.97 36.9,12.97 34.15,11.87 34.7,11.87 35.25,11.87 35.8,11.87 36.35,11.87 36.9,11.87 34.15,10.77 34.7,10.77 35.25,10.77 35.8,10.77 36.35,10.77 36.9,10.77 34.15,11.32 34.7,11.32 35.25,11.32 35.8,11.32 36.35,11.32 36.9,11.32 38,20.62 38.55,20.62 39.1,20.62 39.65,20.62 40.2,20.62 40.75,20.62 38,21.17 38.55,21.17 39.1,21.17 39.65,21.17 40.2,21.17 40.75,21.17 38,20.07 38.55,20.07 39.1,20.07 39.65,20.07 40.2,20.07 40.75,20.07 38,18.97 38.55,18.97 39.1,18.97 39.65,18.97 40.2,18.97 40.75,18.97 38,19.52 38.55,19.52 39.1,19.52 39.65,19.52 40.2,19.52 40.75,19.52 38,18.42 38.55,18.42 39.1,18.42 39.65,18.42 40.2,18.42 40.75,18.42 38,17.32 38.55,17.32 38,17.87 38.55,17.87 39.1,17.87 39.65,17.87 40.2,17.87 40.75,17.87
  pour Top (rank 3, no thermals): 43.85,21.57 37.5,21.57 37.5,16.87 33.7,16.87 33.7,8.42 43.85,8.42
  pour Bottom (rank 2, no thermals): 30.2,21.37 30.2,3.57 41.4,3.57 41.4,21.37
PHASE_A_CURRENT_SHUNT_N  (via drill 0.2 pad 0.55)
  Top 0.15: R18.S1 v32.7,17.74
  Bottom 0.15: v32.7,17.74 32.7,21.59 32.23,22.07 30.69,22.07 29.83,22.93 29.83,26.79 30.03,26.99 30.03,30.09 29.05,31.07 29.05,40.62 28.85,40.82 28.4,40.82 28,40.42 MODULE2.13
PHASE_A_CURRENT_SHUNT_P  (via drill 0.2 pad 0.55)
  Top 0.15: R18.S2 v32.7,26.69
  Bottom 0.15: v32.7,26.69 32.7,22.84 32.24,22.38 30.85,22.38 30.13,23.11 30.13,26.67 30.33,26.87 30.33,30.22 29.35,31.19 29.35,40.74 28.97,41.12 28.4,41.12 28,41.52 MODULE2.14
PHASE_A_GATE_HIGH
  Top 0.2: R14.1 R15.1 26.65,12.47 26.65,12.62 28,13.97 MODULE2.1
PHASE_A_GATE_LOW
  Top 0.2: R17.1 27.58,12.49 28.63,12.49 R16.1 28.7,12.47 28.7,12.49 29.05,12.84 29.05,18.92 MODULE2.3
PHASE_A_GND  (via drill 0.2 pad 0.55)
  Top 0.2: MODULE2.4 29.83,21.97 v30.63,21.17
  other vias: 30.63,20.62 30.63,20.07 30.63,19.52 30.63,18.97 30.63,18.42 34.78,21.17 34.78,20.62 34.78,20.07 34.78,19.52 34.78,18.97 34.78,18.42 30.6,11.94 30.6,12.49 30.6,13.04 30.6,13.59 30.6,14.14 30.6,14.69 30.6,15.24 30.6,15.79
  pour Top (rank 4, no thermals): 36.85,11.77 30.4,11.77 30.4,21.42 36.85,21.42
  pour Bottom (no thermals): 32.73,11.74 30.4,11.74 30.4,21.42 34.95,21.42 34.95,15.47 32.73,15.47
PHASE_B  (via drill 0.2 pad 0.55)
  Route15 0.2: MODULE2.6 27.53,26.44 27.09,26.44 26.75,26.78 26.75,28.27 27.05,28.57 27.05,30.22 26.18,31.09 26.18,37.49 27.66,38.97 28.5,38.97 30.35,40.82 37.7,40.82 v37.95,40.57
  other vias: 34.1,43.82 34.65,43.82 35.2,43.82 35.75,43.82 36.3,43.82 36.85,43.82 34.1,43.27 34.65,43.27 35.2,43.27 35.75,43.27 36.3,43.27 36.85,43.27 34.1,44.37 34.65,44.37 35.2,44.37 35.75,44.37 36.3,44.37 36.85,44.37 34.1,45.47 34.65,45.47 35.2,45.47 35.75,45.47 36.3,45.47 36.85,45.47 34.1,44.92 34.65,44.92 35.2,44.92 35.75,44.92 36.3,44.92 36.85,44.92 34.1,46.02 34.65,46.02 35.2,46.02 35.75,46.02 36.3,46.02 36.85,46.02 34.1,47.12 34.65,47.12 35.2,47.12 35.75,47.12 36.3,47.12 36.85,47.12 34.1,46.57 34.65,46.57 35.2,46.57 35.75,46.57 36.3,46.57 36.85,46.57 37.95,40.02 38.5,40.02 39.05,40.02 39.6,40.02 40.15,40.02 40.7,40.02 38.5,40.57 37.95,39.47 38.5,39.47 39.05,39.47 39.6,39.47 40.15,39.47 40.7,39.47 37.95,38.37 38.5,38.37 39.05,38.37 39.6,38.37 40.15,38.37 40.7,38.37 37.95,38.92 38.5,38.92 39.05,38.92 39.6,38.92 40.15,38.92 40.7,38.92 37.95,37.82 38.5,37.82 39.05,37.82 39.6,37.82 40.15,37.82 40.7,37.82 37.95,36.72 38.5,36.72 39.05,36.72 39.6,36.72 40.15,36.72 40.7,36.72 37.95,37.27 38.5,37.27 39.05,37.27 39.6,37.27 40.15,37.27 40.7,37.27
  pour Top (rank 3, no thermals): 43.85,36.52 37.5,36.52 37.5,41.89 33.75,41.89 33.75,49.32 43.85,49.32
  pour Bottom (rank 2, no thermals): 30.2,54.37 30.2,36.52 41.4,36.52 41.4,54.37
PHASE_B_CURRENT_SHUNT_N  (via drill 0.2 pad 0.55)
  Top 0.15: v32.7,40.19 R5.S1
  Bottom 0.15: v32.7,40.19 32.7,36.27 32.3,35.87 30.96,35.87 30.1,36.73 30.1,42.13 28.71,43.52 27.64,43.52 25.89,41.77 24.91,41.77 24.66,42.03 24.66,42.33 25.3,42.97 MODULE2.15
PHASE_B_CURRENT_SHUNT_P  (via drill 0.2 pad 0.55)
  Top 0.15: v32.7,31.24 R5.S2
  Bottom 0.15: 24.44,41.81 24.79,41.47 26.01,41.47 27.76,43.22 28.59,43.22 29.8,42.01 29.8,36.61 30.84,35.57 32.3,35.57 32.7,35.17 v32.7,31.24 | 24.44,41.81 | 24.44,41.81 24.36,41.9 24.36,42.32 23.71,42.97 MODULE2.16
PHASE_B_GATE_HIGH
  Bottom 0.2: R2.1 R1.1 27.9,24.07 MODULE2.5
PHASE_B_GATE_LOW
  Bottom 0.2: R4.1 R3.1 MODULE2.7
PHASE_B_GND  (via drill 0.2 pad 0.55)
  Top 0.2: MODULE2.8 26.45,31.52 26.45,38.37 27.05,38.97 30.45,38.97 v30.63,39.14
  other vias: 30.63,39.69 30.63,38.59 30.63,38.04 30.63,37.49 30.63,36.94 34.78,39.69 34.78,39.14 34.78,38.59 34.78,38.04 34.78,37.49 30.63,47.14 30.63,46.59 30.63,46.04 30.63,45.49 30.63,44.94 30.63,44.39 30.63,43.84 30.63,43.29
  pour Top (rank 4, no thermals): 36.85,47.37 30.4,47.37 30.4,36.62 36.85,36.62
  pour Bottom: 30.59,36.71 30.2,36.7 30.2,39.87 34.98,39.87 34.98,36.74 30.55,36.74
  pour Bottom (no thermals): 30.4,47.39 33.33,47.39 33.33,41.49 35,41.49 35,36.77 30.4,36.76
PHASE_C  (via drill 0.2 pad 0.55)
  Route15 0.2: v37.95,35.07 37.75,35.27 29.9,35.27 28.6,33.97 MODULE2.10
  other vias: 37.95,25.67 38.5,25.67 39.05,25.67 39.6,25.67 40.15,25.67 40.7,25.67 37.95,24.57 38.5,24.57 39.05,24.57 39.6,24.57 40.15,24.57 40.7,24.57 37.95,25.12 38.5,25.12 39.05,25.12 39.6,25.12 40.15,25.12 40.7,25.12 37.95,24.02 38.5,24.02 39.05,24.02 39.6,24.02 40.15,24.02 40.7,24.02 37.95,22.92 38.5,22.92 39.05,22.92 39.6,22.92 40.15,22.92 40.7,22.92 37.95,23.47 38.5,23.47 39.05,23.47 39.6,23.47 40.15,23.47 40.7,23.47 37.95,34.52 38.5,34.52 39.05,34.52 39.6,34.52 40.15,34.52 40.7,34.52 38.5,35.07 39.05,35.07 39.6,35.07 40.15,35.07 40.7,35.07 37.95,33.97 38.5,33.97 39.05,33.97 39.6,33.97 40.15,33.97 40.7,33.97 37.95,32.87 38.5,32.87 39.05,32.87 39.6,32.87 40.15,32.87 40.7,32.87 37.95,33.42 38.5,33.42 39.05,33.42 39.6,33.42 40.15,33.42 40.7,33.42 37.95,32.32 38.5,32.32 39.05,32.32 39.6,32.32 40.15,32.32 40.7,32.32 37.95,31.22 38.5,31.22 39.05,31.22 39.6,31.22 40.15,31.22 40.7,31.22 37.95,31.77 38.5,31.77 39.05,31.77 39.6,31.77 40.15,31.77 40.7,31.77
  pour Top (no thermals): 43.85,35.57 37.5,35.57 37.5,22.67 43.85,22.67
  pour Bottom (rank 2, no thermals): 30.2,36.07 30.2,21.87 41.4,21.87 41.4,36.07
PHASE_C_GATE_HIGH
  Bottom 0.2: R22.1 26.53,31.97 | 26.53,31.97 R21.1 | 26.53,31.97 26.58,31.92 27.95,31.92 MODULE2.9
PHASE_C_GATE_LOW
  Bottom 0.2: R24.1 R23.1 26.23,35.94 26.25,35.97 MODULE2.11
PHASE_C_GND
  Top 0.2: S1.IN 30.08,30.82 29.55,31.34 29.55,36.42 MODULE2.12
TEMPERATURE_SENSOR  (via drill 0.2 pad 0.55)
  Top 0.3: IC5.2 28.8,45.79 23.25,45.79 v22.95,45.49
  Bottom 0.3: v22.95,45.49 22.23,45.49 21.5,44.77 21.5,44.57 C13.2 21.5,44.47 MODULE2.17
UART_RX
  Top 0.2: R29.2 17.45,52.42 16.9,51.87 16.9,51.32 14.95,49.37 14.95,46.92 12.05,44.02 10.55,44.02 MODULE2.20
UART_TX
  Top 0.2: R28.2 15.35,49.19 15.35,46.67 11.65,42.97 MODULE2.19
USB_VBUS  (via drill 0.2 pad 0.55)
  Top 0.2: v8.15,33.47 8.75,33.47 10.25,34.97 v10.25,35.17
  Bottom 0.2: D4.4 v10.25,35.17
  Bottom 0.4: D2.A 7.55,24.09 7.55,27.12 8.1,27.67 | CON1.1 8.1,27.67 | R6.2 v8.15,33.47 8.15,27.72 8.1,27.67
VDC  (via drill 0.2 pad 0.55)
  Route15 1.5: MODULE2.42 29.85,10.62 31.4,10.62
  other vias: 44.6,46.57 45.15,46.57 45.7,46.57 46.25,46.57 46.8,46.57 47.35,46.57 44.6,47.12 45.15,47.12 45.7,47.12 46.25,47.12 46.8,47.12 47.35,47.12 44.6,46.02 45.15,46.02 45.7,46.02 46.25,46.02 46.8,46.02 47.35,46.02 44.6,44.92 45.15,44.92 45.7,44.92 46.25,44.92 46.8,44.92 47.35,44.92 44.6,45.47 45.15,45.47 45.7,45.47 46.25,45.47 46.8,45.47 47.35,45.47 44.6,44.37 45.15,44.37 45.7,44.37 46.25,44.37 46.8,44.37 47.35,44.37 44.6,43.27 45.15,43.27 45.7,43.27 46.25,43.27 46.8,43.27 47.35,43.27 44.6,43.82 45.15,43.82 45.7,43.82 46.25,43.82 46.8,43.82 47.35,43.82 45.2,40.17 45.75,40.17 46.3,40.17 46.85,40.17 47.4,40.17 47.95,40.17 45.2,40.72 45.75,40.72 46.3,40.72 46.85,40.72 47.4,40.72 47.95,40.72 45.2,39.62 45.75,39.62 46.3,39.62 46.85,39.62 47.4,39.62 47.95,39.62 45.2,38.52 45.75,38.52 46.3,38.52 46.85,38.52 47.4,38.52 47.95,38.52 45.2,39.07 45.75,39.07 46.3,39.07 46.85,39.07 47.4,39.07 47.95,39.07 45.2,37.97 45.75,37.97 46.3,37.97 46.85,37.97 47.4,37.97 47.95,37.97 45.2,36.87 45.75,36.87 46.3,36.87 46.85,36.87 47.4,36.87 47.95,36.87 45.2,37.42 45.75,37.42 46.3,37.42 46.85,37.42 47.4,37.42 47.95,37.42 45.15,34.77 45.7,34.77 46.25,34.77 46.8,34.77 47.35,34.77 47.9,34.77 45.15,35.32 45.7,35.32 46.25,35.32 46.8,35.32 47.35,35.32 47.9,35.32 45.15,34.22 45.7,34.22 46.25,34.22 46.8,34.22 47.35,34.22 47.9,34.22 45.15,33.12 45.7,33.12 46.25,33.12 46.8,33.12 47.35,33.12 47.9,33.12 45.15,33.67 45.7,33.67 46.25,33.67 46.8,33.67 47.35,33.67 47.9,33.67 45.15,32.57 45.7,32.57 46.25,32.57 46.8,32.57 47.35,32.57 47.9,32.57 45.15,32.02 45.7,32.02 46.25,32.02 46.8,32.02 47.35,32.02 47.9,32.02 45.2,25.87 45.75,25.87 46.3,25.87 46.85,25.87 47.4,25.87 47.95,25.87 45.2,25.32 45.75,25.32 46.3,25.32 46.85,25.32 47.4,25.32 47.95,25.32 45.2,24.22 45.75,24.22 46.3,24.22 46.85,24.22 47.4,24.22 47.95,24.22 45.2,24.77 45.75,24.77 46.3,24.77 46.85,24.77 47.4,24.77 47.95,24.77 45.2,23.67 45.75,23.67 46.3,23.67 46.85,23.67 47.4,23.67 47.95,23.67 45.2,22.57 45.75,22.57 46.3,22.57 46.85,22.57 47.4,22.57 47.95,22.57 45.2,23.12 45.75,23.12 46.3,23.12 46.85,23.12 47.4,23.12 47.95,23.12 45.15,20.52 45.7,20.52 46.25,20.52 46.8,20.52 47.35,20.52 47.9,20.52 45.15,21.07 45.7,21.07 46.25,21.07 46.8,21.07 47.35,21.07 47.9,21.07 45.15,19.97 45.7,19.97 46.25,19.97 46.8,19.97 47.35,19.97 47.9,19.97 45.15,18.87 45.7,18.87 46.25,18.87 46.8,18.87 47.35,18.87 47.9,18.87 45.15,19.42 45.7,19.42 46.25,19.42 46.8,19.42 47.35,19.42 47.9,19.42 45.15,18.32 45.7,18.32 46.25,18.32 46.8,18.32 47.35,18.32 47.9,18.32 45.15,17.22 45.7,17.22 46.25,17.22 46.8,17.22 47.35,17.22 47.9,17.22 45.15,17.77 45.7,17.77 46.25,17.77 46.8,17.77 47.35,17.77 47.9,17.77 44.6,14.07 45.15,14.07 45.7,14.07 46.25,14.07 46.8,14.07 47.35,14.07 44.6,14.62 45.15,14.62 45.7,14.62 46.25,14.62 46.8,14.62 47.35,14.62 44.6,13.52 45.15,13.52 45.7,13.52 46.25,13.52 46.8,13.52 47.35,13.52 44.6,12.42 45.15,12.42 45.7,12.42 46.25,12.42 46.8,12.42 47.35,12.42 44.6,12.97 45.15,12.97 45.7,12.97 46.25,12.97 46.8,12.97 47.35,12.97 44.6,11.87 45.15,11.87 45.7,11.87 46.25,11.87 46.8,11.87 47.35,11.87 44.6,10.77 45.15,10.77 45.7,10.77 46.25,10.77 46.8,10.77 47.35,10.77 44.6,11.32 45.15,11.32 45.7,11.32 46.25,11.32 46.8,11.32 47.35,11.32 32.88,5.97 33.43,5.97 33.43,6.52 32.88,6.52 33.43,5.42 32.88,5.42 30.53,5.99 30.53,6.54 30.53,5.44 32.88,51.97 33.43,51.97 33.43,52.52 32.88,52.52 33.43,51.42 32.88,51.42
  pour Top (rank 2, no thermals): 51.2,50.87 43.1,50.87 43.1,48.57 44.3,48.57 44.3,9.67 43.3,9.67 43.3,6.77 51.2,6.77
  pour Bottom (no thermals): 41.9,54.97 41.9,5.97 51.9,5.97 51.9,54.97
  pour Top (no thermals): 45.65,49.35 44.8,48.26
  pour Route15 (no thermals): 30.2,54.37 30.2,3.57 52.2,3.57 52.2,54.37
  pour Top (no thermals): 30.35,8.12 33.7,8.12 33.7,5.22 30.35,5.22
  pour Bottom (no thermals): 33.7,6.72 23.75,6.72 23.75,3.57 33.7,3.57
  pour Top (no thermals): 30.93,52.87 33.6,52.87 33.6,49.82 30.93,49.82
VDD_5V  (via drill 0.2 pad 0.55)
  Top 0.2: v16.3,48.07 17.1,48.07
  Top 0.3: R27.2 24.35,44.84 21.65,44.84
  Top 0.4: D7.2 D7.5 17.1,48.07 17.1,48.64 18.1,49.64 21.43,49.64 v21.65,49.42
  Top 0.5: v12.18,16.09 21.38,16.09 | 21.38,16.09 21.5,15.97 MODULE2.40 21.5,13.22 C45.1 | v26.85,22.77 26.75,22.77 | 21.38,16.09 24.93,16.09 25,16.17 25.05,16.17 26.75,17.87 26.75,22.77 | 26.75,22.77 26.75,23.02 26.4,23.37 26.4,27.87 25.6,28.67 25.6,30.35 24.75,31.2 v24.75,33.47 24.75,36.47 24.28,36.94 20.38,36.94 | v12.18,16.09 12.18,16.74 v9.53,19.39 6.68,19.39 v6.15,18.87 | v13.08,37.49 v13.08,36.94 20.38,36.94 | v21.65,49.42 v21.65,48.87 21.65,44.84 20.38,43.57 20.38,36.94 | v8.18,16.09 v12.18,16.09
  Route15 0.5: v9.14,23.86 10.7,22.3 10.7,19.02 12.7,17.02 19.45,17.02 MODULE2.40
  Bottom 0.2: C11.1 IC4.5 6.93,19.52 6.35,19.52 6.15,19.32 v6.15,18.87 | IC3.3 10.88,16.29 11.08,16.09 v12.18,16.09 | IC4.3 7.58,16.39 7.88,16.09 v8.18,16.09 | C12.1 IC3.5 10.23,19.59 10.03,19.39 v9.53,19.39 | IC2.3 19.08,8.19 C3.1 | IC1.3 15.9,8.14 C4.1 | LED2.A 24.75,33.22 v24.75,33.47 | LED1.A v26.85,22.77 | LED5.A 15.03,48.07 v16.3,48.07
  Bottom 0.5: 18.9,7.09 21.23,7.09 21.9,7.77 21.9,14.57 MODULE2.40 | 18.9,7.09 16.58,7.09 15.88,7.79 C4.1 | C3.1 19,7.19 18.9,7.09 | F1.P$2 11.68,37.49 v13.08,37.49 | LED3.+ v21.65,48.87 CON8.1
  other vias: 8.59,24.41 9.14,24.41 8.59,23.84
  pour Bottom (no thermals): 10.98,24.62 8.43,24.62 8.43,23.62 10.98,23.62
  pour Top (no thermals): 9.4,24.62 8.38,24.62 8.38,23.62 9.4,23.62
  pour Bottom (no thermals): 11.78,37.67 13.38,37.67 13.38,36.69 11.78,36.69
  pour Route15 (no thermals): 9.4,24.62 8.38,24.62 8.38,23.62 9.4,23.62

### Text on the board
Top: OpenMyxa0.3
tPlace: Propelled / by Télega
bPlace: T | GND